# Altium project Placa_registros.PrjPcb (part 1 of 2)
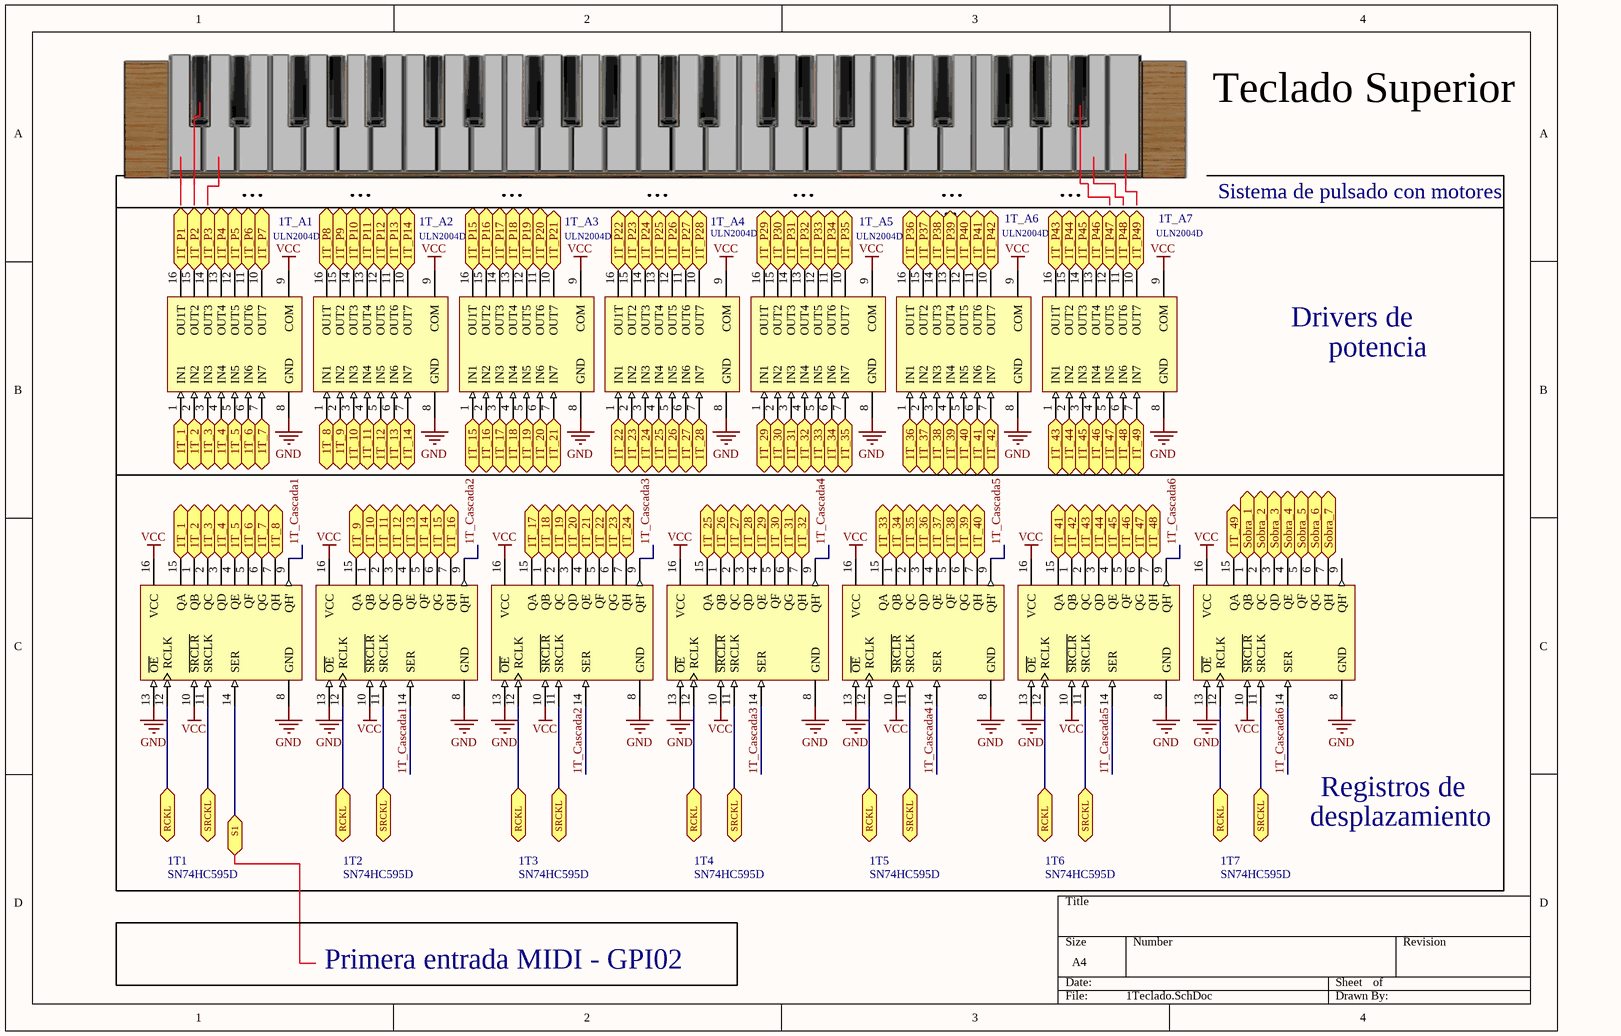
[diagram p0: 1Teclado.SchDoc]
10 sheets, 324 parts. Net scope: flat (ports and power ports of the same name join across sheets).
Board file: PCB_Organo.PcbDoc
Sheets:
  1Teclado.SchDoc
  2Teclado.SchDoc
  Valvulas.SchDoc
  Pedal.SchDoc
  Externos.SchDoc
  GPIO_Raspberry_b+.SchDoc
  LED´s_1Teclado.SchDoc
  LED´s_Teclado2.SchDoc
  LED´s_Valvulas.SchDoc
  LED´s_Pedal.SchDoc

## Sheet 1Teclado.SchDoc
size A4

### Parts
1T1  SN74HC595D  [D016_N]
1T2  SN74HC595D  [D016_N]
1T3  SN74HC595D  [D016_N]
1T4  SN74HC595D  [D016_N]
1T5  SN74HC595D  [D016_N]
1T6  SN74HC595D  [D016_N]
1T7  SN74HC595D  [D016_N]
1T_A1  ULN2004D  [SO16_N]
1T_A2  ULN2004D  [SO16_N]
1T_A3  ULN2004D  [SO16_N]
1T_A4  ULN2004D  [SO16_N]
1T_A5  ULN2004D  [SO16_N]
1T_A6  ULN2004D  [SO16_N]
1T_A7  ULN2004D  [SO16_N]

### Ports
1T_1, 1T_2, 1T_3, 1T_4, 1T_5, 1T_6, 1T_7, 1T_8, 1T_9, 1T_10, 1T_11, 1T_12, 1T_13, 1T_14, 1T_15, 1T_16, 1T_17, 1T_18, 1T_19, 1T_20, 1T_21, 1T_22, 1T_23, 1T_24, 1T_25, 1T_26, 1T_27, 1T_28, 1T_29, 1T_30, 1T_31, 1T_32, 1T_33, 1T_34, 1T_35, 1T_36, 1T_37, 1T_38, 1T_39, 1T_40, 1T_41, 1T_42, 1T_43, 1T_44, 1T_45, 1T_46, 1T_47, 1T_48, 1T_49, 1T_P1, 1T_P2, 1T_P3, 1T_P4, 1T_P5, 1T_P6, 1T_P7, 1T_P8, 1T_P9, 1T_P10, 1T_P11, 1T_P12, 1T_P13, 1T_P14, 1T_P15, 1T_P16, 1T_P17, 1T_P18, 1T_P19, 1T_P20, 1T_P21, 1T_P22, 1T_P23, 1T_P24, 1T_P25, 1T_P26, 1T_P27, 1T_P28, 1T_P29, 1T_P30, 1T_P31, 1T_P32, 1T_P33, 1T_P34, 1T_P35, 1T_P36, 1T_P37, 1T_P38, 1T_P39, 1T_P40, 1T_P41, 1T_P42, 1T_P43, 1T_P44, 1T_P45, 1T_P46, 1T_P47, 1T_P48, 1T_P49, RCKL, S1, Sobra_1, Sobra_2, Sobra_3, Sobra_4, Sobra_5, Sobra_6, Sobra_7, SRCKL

### Nets
GND: 1T1.8(GND) 1T1.13(~{OE}) 1T2.8(GND) 1T2.13(~{OE}) 1T3.8(GND) 1T3.13(~{OE}) 1T4.8(GND) 1T4.13(~{OE}) 1T5.8(GND) 1T5.13(~{OE}) 1T6.8(GND) 1T6.13(~{OE}) 1T7.8(GND) 1T7.13(~{OE}) 1T_A1.8(GND) 1T_A2.8(GND) 1T_A3.8(GND) 1T_A4.8(GND) 1T_A5.8(GND) 1T_A6.8(GND) 1T_A7.8(GND)
VCC: 1T1.10(~{SRCLR}) 1T1.16(VCC) 1T2.10(~{SRCLR}) 1T2.16(VCC) 1T3.10(~{SRCLR}) 1T3.16(VCC) 1T4.10(~{SRCLR}) 1T4.16(VCC) 1T5.10(~{SRCLR}) 1T5.16(VCC) 1T6.10(~{SRCLR}) 1T6.16(VCC) 1T7.10(~{SRCLR}) 1T7.16(VCC) 1T_A1.9(COM) 1T_A2.9(COM) 1T_A3.9(COM) 1T_A4.9(COM) 1T_A5.9(COM) 1T_A6.9(COM) 1T_A7.9(COM)
1T_Cascada1: 1T1.9(QH') 1T2.14(SER)
1T_Cascada2: 1T2.9(QH') 1T3.14(SER)
1T_Cascada3: 1T3.9(QH') 1T4.14(SER)
1T_Cascada4: 1T4.9(QH') 1T5.14(SER)
1T_Cascada5: 1T5.9(QH') 1T6.14(SER)
1T_Cascada6: 1T6.9(QH') 1T7.14(SER)
Net1T1_1: 1T1.1(QB) 1T_A1.2(IN2) ; port 1T_2
Net1T1_2: 1T1.2(QC) 1T_A1.3(IN3) ; port 1T_3
Net1T1_3: 1T1.3(QD) 1T_A1.4(IN4) ; port 1T_4
Net1T1_4: 1T1.4(QE) 1T_A1.5(IN5) ; port 1T_5
Net1T1_5: 1T1.5(QF) 1T_A1.6(IN6) ; port 1T_6
Net1T1_6: 1T1.6(QG) 1T_A1.7(IN7) ; port 1T_7
Net1T1_7: 1T1.7(QH) 1T_A2.1(IN1) ; port 1T_8
Net1T1_11: 1T1.11(SRCLK) 1T2.11(SRCLK) 1T3.11(SRCLK) 1T4.11(SRCLK) 1T5.11(SRCLK) 1T6.11(SRCLK) 1T7.11(SRCLK) ; port SRCKL
Net1T1_12: 1T1.12(RCLK) 1T2.12(RCLK) 1T3.12(RCLK) 1T4.12(RCLK) 1T5.12(RCLK) 1T6.12(RCLK) 1T7.12(RCLK) ; port RCKL
Net1T1_14: 1T1.14(SER) ; port S1
Net1T1_15: 1T1.15(QA) 1T_A1.1(IN1) ; port 1T_1
Net1T2_1: 1T2.1(QB) 1T_A2.3(IN3) ; port 1T_10
Net1T2_2: 1T2.2(QC) 1T_A2.4(IN4) ; port 1T_11
Net1T2_3: 1T2.3(QD) 1T_A2.5(IN5) ; port 1T_12
Net1T2_4: 1T2.4(QE) 1T_A2.6(IN6) ; port 1T_13
Net1T2_5: 1T2.5(QF) 1T_A2.7(IN7) ; port 1T_14
Net1T2_6: 1T2.6(QG) 1T_A3.1(IN1) ; port 1T_15
Net1T2_7: 1T2.7(QH) 1T_A3.2(IN2) ; port 1T_16
Net1T2_15: 1T2.15(QA) 1T_A2.2(IN2) ; port 1T_9
Net1T3_1: 1T3.1(QB) 1T_A3.4(IN4) ; port 1T_18
Net1T3_2: 1T3.2(QC) 1T_A3.5(IN5) ; port 1T_19
Net1T3_3: 1T3.3(QD) 1T_A3.6(IN6) ; port 1T_20
Net1T3_4: 1T3.4(QE) 1T_A3.7(IN7) ; port 1T_21
Net1T3_5: 1T3.5(QF) 1T_A4.1(IN1) ; port 1T_22
Net1T3_6: 1T3.6(QG) 1T_A4.2(IN2) ; port 1T_23
Net1T3_7: 1T3.7(QH) 1T_A4.3(IN3) ; port 1T_24
Net1T3_15: 1T3.15(QA) 1T_A3.3(IN3) ; port 1T_17
Net1T4_1: 1T4.1(QB) 1T_A4.5(IN5) ; port 1T_26
Net1T4_2: 1T4.2(QC) 1T_A4.6(IN6) ; port 1T_27
Net1T4_3: 1T4.3(QD) 1T_A4.7(IN7) ; port 1T_28
Net1T4_4: 1T4.4(QE) 1T_A5.1(IN1) ; port 1T_29
Net1T4_5: 1T4.5(QF) 1T_A5.2(IN2) ; port 1T_30
Net1T4_6: 1T4.6(QG) 1T_A5.3(IN3) ; port 1T_31
Net1T4_7: 1T4.7(QH) 1T_A5.4(IN4) ; port 1T_32
Net1T4_15: 1T4.15(QA) 1T_A4.4(IN4) ; port 1T_25
Net1T5_1: 1T5.1(QB) 1T_A5.6(IN6) ; port 1T_34
Net1T5_2: 1T5.2(QC) 1T_A5.7(IN7) ; port 1T_35
Net1T5_3: 1T5.3(QD) 1T_A6.1(IN1) ; port 1T_36
Net1T5_4: 1T5.4(QE) 1T_A6.2(IN2) ; port 1T_37
Net1T5_5: 1T5.5(QF) 1T_A6.3(IN3) ; port 1T_38
Net1T5_6: 1T5.6(QG) 1T_A6.4(IN4) ; port 1T_39
Net1T5_7: 1T5.7(QH) 1T_A6.5(IN5) ; port 1T_40
Net1T5_15: 1T5.15(QA) 1T_A5.5(IN5) ; port 1T_33
Net1T6_1: 1T6.1(QB) 1T_A6.7(IN7) ; port 1T_42
Net1T6_2: 1T6.2(QC) 1T_A7.1(IN1) ; port 1T_43
Net1T6_3: 1T6.3(QD) 1T_A7.2(IN2) ; port 1T_44
Net1T6_4: 1T6.4(QE) 1T_A7.3(IN3) ; port 1T_45
Net1T6_5: 1T6.5(QF) 1T_A7.4(IN4) ; port 1T_46
Net1T6_6: 1T6.6(QG) 1T_A7.5(IN5) ; port 1T_47
Net1T6_7: 1T6.7(QH) 1T_A7.6(IN6) ; port 1T_48
Net1T6_15: 1T6.15(QA) 1T_A6.6(IN6) ; port 1T_41
Net1T7_1: 1T7.1(QB) ; port Sobra_1
Net1T7_2: 1T7.2(QC) ; port Sobra_2
Net1T7_3: 1T7.3(QD) ; port Sobra_3
Net1T7_4: 1T7.4(QE) ; port Sobra_4
Net1T7_5: 1T7.5(QF) ; port Sobra_5
Net1T7_6: 1T7.6(QG) ; port Sobra_6
Net1T7_7: 1T7.7(QH) ; port Sobra_7
Net1T7_15: 1T7.15(QA) 1T_A7.7(IN7) ; port 1T_49
Net1T_A1_10: 1T_A1.10(OUT7) ; port 1T_P7
Net1T_A1_11: 1T_A1.11(OUT6) ; port 1T_P6
Net1T_A1_12: 1T_A1.12(OUT5) ; port 1T_P5
Net1T_A1_13: 1T_A1.13(OUT4) ; port 1T_P4
Net1T_A1_14: 1T_A1.14(OUT3) ; port 1T_P3
Net1T_A1_15: 1T_A1.15(OUT2) ; port 1T_P2
Net1T_A1_16: 1T_A1.16(OU1T) ; port 1T_P1
Net1T_A2_10: 1T_A2.10(OUT7) ; port 1T_P14
Net1T_A2_11: 1T_A2.11(OUT6) ; port 1T_P13
Net1T_A2_12: 1T_A2.12(OUT5) ; port 1T_P12
Net1T_A2_13: 1T_A2.13(OUT4) ; port 1T_P11
Net1T_A2_14: 1T_A2.14(OUT3) ; port 1T_P10
Net1T_A2_15: 1T_A2.15(OUT2) ; port 1T_P9
Net1T_A2_16: 1T_A2.16(OU1T) ; port 1T_P8
Net1T_A3_10: 1T_A3.10(OUT7) ; port 1T_P21
Net1T_A3_11: 1T_A3.11(OUT6) ; port 1T_P20
Net1T_A3_12: 1T_A3.12(OUT5) ; port 1T_P19
Net1T_A3_13: 1T_A3.13(OUT4) ; port 1T_P18
Net1T_A3_14: 1T_A3.14(OUT3) ; port 1T_P17
Net1T_A3_15: 1T_A3.15(OUT2) ; port 1T_P16
Net1T_A3_16: 1T_A3.16(OU1T) ; port 1T_P15
Net1T_A4_10: 1T_A4.10(OUT7) ; port 1T_P28
Net1T_A4_11: 1T_A4.11(OUT6) ; port 1T_P27
Net1T_A4_12: 1T_A4.12(OUT5) ; port 1T_P26
Net1T_A4_13: 1T_A4.13(OUT4) ; port 1T_P25
Net1T_A4_14: 1T_A4.14(OUT3) ; port 1T_P24
Net1T_A4_15: 1T_A4.15(OUT2) ; port 1T_P23
Net1T_A4_16: 1T_A4.16(OU1T) ; port 1T_P22
Net1T_A5_10: 1T_A5.10(OUT7) ; port 1T_P35
Net1T_A5_11: 1T_A5.11(OUT6) ; port 1T_P34
Net1T_A5_12: 1T_A5.12(OUT5) ; port 1T_P33
Net1T_A5_13: 1T_A5.13(OUT4) ; port 1T_P32
Net1T_A5_14: 1T_A5.14(OUT3) ; port 1T_P31
Net1T_A5_15: 1T_A5.15(OUT2) ; port 1T_P30
Net1T_A5_16: 1T_A5.16(OU1T) ; port 1T_P29
Net1T_A6_10: 1T_A6.10(OUT7) ; port 1T_P42
Net1T_A6_11: 1T_A6.11(OUT6) ; port 1T_P41
Net1T_A6_12: 1T_A6.12(OUT5) ; port 1T_P40
Net1T_A6_13: 1T_A6.13(OUT4) ; port 1T_P39
Net1T_A6_14: 1T_A6.14(OUT3) ; port 1T_P38
Net1T_A6_15: 1T_A6.15(OUT2) ; port 1T_P37
Net1T_A6_16: 1T_A6.16(OU1T) ; port 1T_P36
Net1T_A7_10: 1T_A7.10(OUT7) ; port 1T_P49
Net1T_A7_11: 1T_A7.11(OUT6) ; port 1T_P48
Net1T_A7_12: 1T_A7.12(OUT5) ; port 1T_P47
Net1T_A7_13: 1T_A7.13(OUT4) ; port 1T_P46
Net1T_A7_14: 1T_A7.14(OUT3) ; port 1T_P45
Net1T_A7_15: 1T_A7.15(OUT2) ; port 1T_P44
Net1T_A7_16: 1T_A7.16(OU1T) ; port 1T_P43

Not connected (* = marked no-connect by the designer): 1T7 9(QH')

### Notes on the sheet
- Teclado Superior
- ...
- Sistema de pulsado con motores
- Drivers de
- potencia
- desplazamiento
- Registros de
- Primera entrada MIDI - GPI02

### Library data of the parts
1T1-1T7 = SN74HC595D: 8-Bit Shift Register with 3-State Output Registers; Published: 8-Jun-2000; LatestRevisionDate: 13-Apr-2006; LatestRevisionNote: IPC-7351 Footprint Added.; DatasheetVersion: May-1997; PackageVersion: Jan-1998; PackageReference: D016; Publisher: Altium Limited; PackageDescription: 16-Pin Small Outline Integrated Circuit 1.27 mm Pitch; Code_IPC: SOIC127P600-16; ComponentLink1Description: Manufacturer Link; ComponentLink1URL: http://www.ti.com/; ComponentLink2Description: Datasheet; ComponentLink2URL: http://www-s.ti.com/sc/ds/sn74hc595.pdf
1T_A1-1T_A7 = ULN2004D: Seven Darlington Array; Published: 8-Jun-2000; LatestRevisionDate: 13-Apr-2006; LatestRevisionNote: IPC-7351 Footprint Added.; DatasheetVersion: Sep-1998; PackageVersion: May-1998; PackageReference: SO16; Publisher: Altium Limited; PackageDescription: 16-Pin Small Outline Integrated Circuit 1.27 mm Pitch; Code_IPC: SOIC127P600-16; ComponentLink1Description: Manufacturer Link; ComponentLink1URL: http://www.st.com/; ComponentLink2Description: Datasheet; ComponentLink2URL: http://www.st.com/stonline/products/literature/ds/5279/uln2001.pdf

## Sheet 2Teclado.SchDoc
size A4
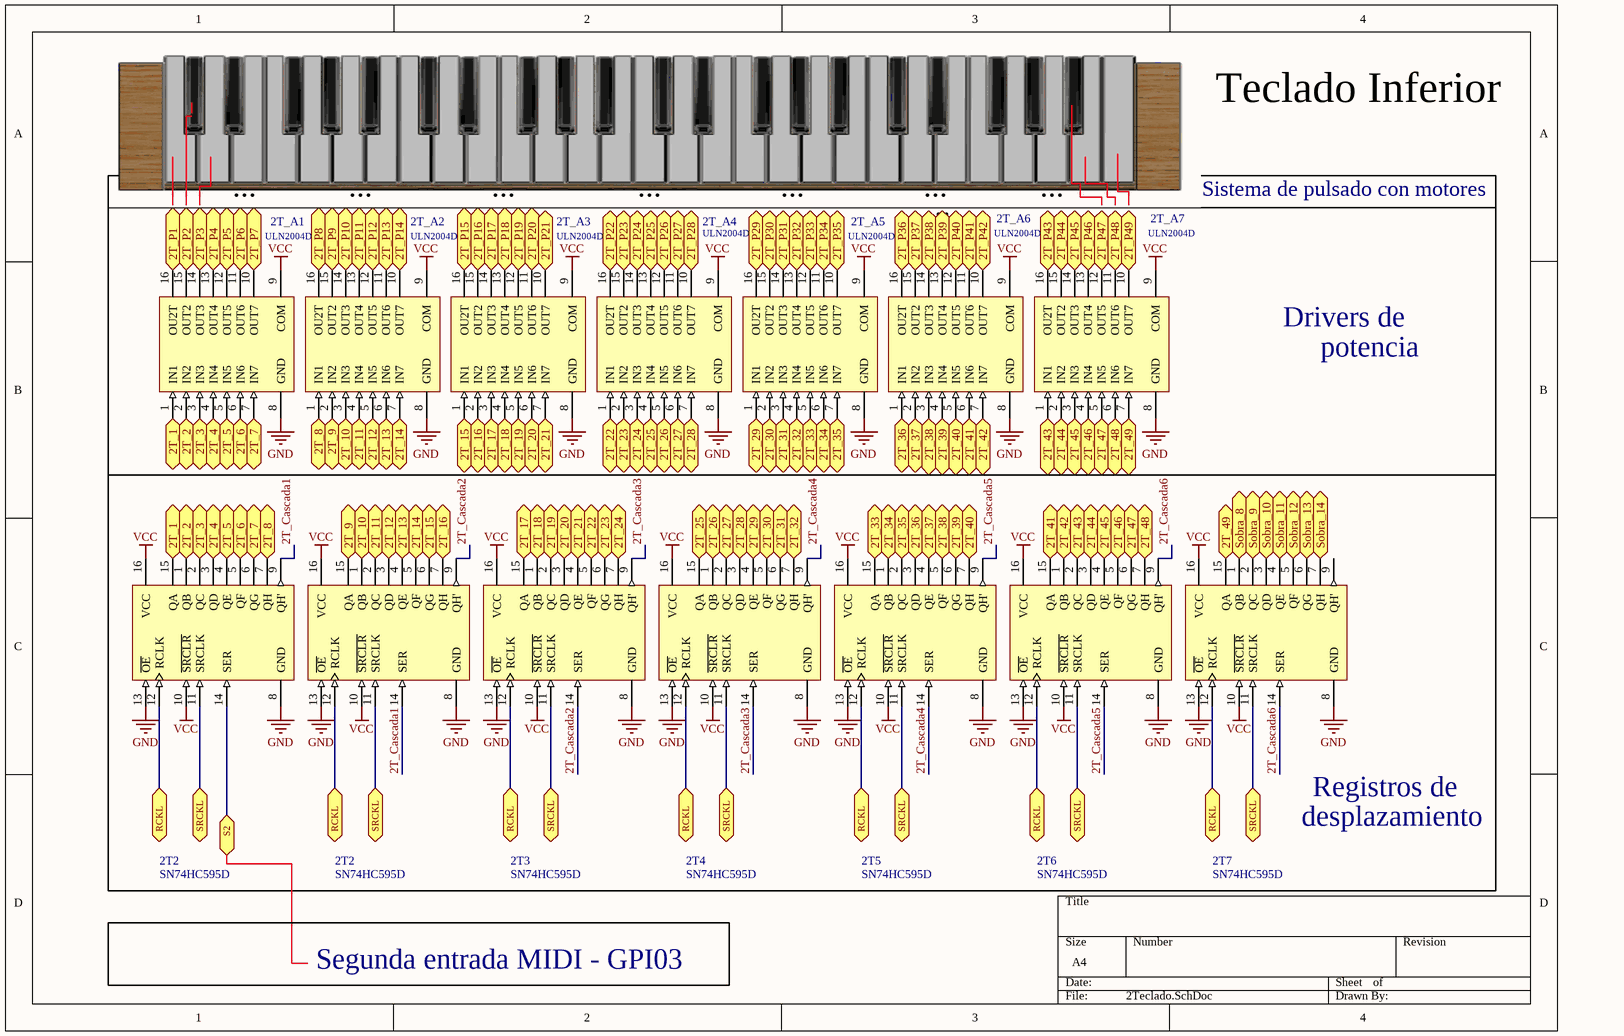
[diagram p1: 2Teclado.SchDoc]

### Parts
(Parts that share a designator on the sheet are numbered #1, #2 ... from top to bottom, then left to right.)
2T2#1  SN74HC595D  [D016_N]
2T2#2  SN74HC595D  [D016_N]
2T3  SN74HC595D  [D016_N]
2T4  SN74HC595D  [D016_N]
2T5  SN74HC595D  [D016_N]
2T6  SN74HC595D  [D016_N]
2T7  SN74HC595D  [D016_N]
2T_A1  ULN2004D  [SO16_N]
2T_A2  ULN2004D  [SO16_N]
2T_A3  ULN2004D  [SO16_N]
2T_A4  ULN2004D  [SO16_N]
2T_A5  ULN2004D  [SO16_N]
2T_A6  ULN2004D  [SO16_N]
2T_A7  ULN2004D  [SO16_N]

### Ports
2T_1, 2T_2, 2T_3, 2T_4, 2T_5, 2T_6, 2T_7, 2T_8, 2T_9, 2T_10, 2T_11, 2T_12, 2T_13, 2T_14, 2T_15, 2T_16, 2T_17, 2T_18, 2T_19, 2T_20, 2T_21, 2T_22, 2T_23, 2T_24, 2T_25, 2T_26, 2T_27, 2T_28, 2T_29, 2T_30, 2T_31, 2T_32, 2T_33, 2T_34, 2T_35, 2T_36, 2T_37, 2T_38, 2T_39, 2T_40, 2T_41, 2T_42, 2T_43, 2T_44, 2T_45, 2T_46, 2T_47, 2T_48, 2T_49, 2T_P1, 2T_P2, 2T_P3, 2T_P4, 2T_P5, 2T_P6, 2T_P7, 2T_P8, 2T_P9, 2T_P10, 2T_P11, 2T_P12, 2T_P13, 2T_P14, 2T_P15, 2T_P16, 2T_P17, 2T_P18, 2T_P19, 2T_P20, 2T_P21, 2T_P22, 2T_P23, 2T_P24, 2T_P25, 2T_P26, 2T_P27, 2T_P28, 2T_P29, 2T_P30, 2T_P31, 2T_P32, 2T_P33, 2T_P34, 2T_P35, 2T_P36, 2T_P37, 2T_P38, 2T_P39, 2T_P40, 2T_P41, 2T_P42, 2T_P43, 2T_P44, 2T_P45, 2T_P46, 2T_P47, 2T_P48, 2T_P49, RCKL, S2, Sobra_8, Sobra_9, Sobra_10, Sobra_11, Sobra_12, Sobra_13, Sobra_14, SRCKL

### Nets
GND: 2T2#1.8(GND) 2T2#1.13(~{OE}) 2T2#2.8(GND) 2T2#2.13(~{OE}) 2T3.8(GND) 2T3.13(~{OE}) 2T4.8(GND) 2T4.13(~{OE}) 2T5.8(GND) 2T5.13(~{OE}) 2T6.8(GND) 2T6.13(~{OE}) 2T7.8(GND) 2T7.13(~{OE}) 2T_A1.8(GND) 2T_A2.8(GND) 2T_A3.8(GND) 2T_A4.8(GND) 2T_A5.8(GND) 2T_A6.8(GND) 2T_A7.8(GND)
VCC: 2T2#1.10(~{SRCLR}) 2T2#1.16(VCC) 2T2#2.10(~{SRCLR}) 2T2#2.16(VCC) 2T3.10(~{SRCLR}) 2T3.16(VCC) 2T4.10(~{SRCLR}) 2T4.16(VCC) 2T5.10(~{SRCLR}) 2T5.16(VCC) 2T6.10(~{SRCLR}) 2T6.16(VCC) 2T7.10(~{SRCLR}) 2T7.16(VCC) 2T_A1.9(COM) 2T_A2.9(COM) 2T_A3.9(COM) 2T_A4.9(COM) 2T_A5.9(COM) 2T_A6.9(COM) 2T_A7.9(COM)
2T_Cascada1: 2T2#1.9(QH') 2T2#2.14(SER)
2T_Cascada2: 2T2#2.9(QH') 2T3.14(SER)
2T_Cascada3: 2T3.9(QH') 2T4.14(SER)
2T_Cascada4: 2T4.9(QH') 2T5.14(SER)
2T_Cascada5: 2T5.9(QH') 2T6.14(SER)
2T_Cascada6: 2T6.9(QH') 2T7.14(SER)
Net1T1_11: 2T2#1.11(SRCLK) 2T2#2.11(SRCLK) 2T3.11(SRCLK) 2T4.11(SRCLK) 2T5.11(SRCLK) 2T6.11(SRCLK) 2T7.11(SRCLK) ; port SRCKL
Net1T1_12: 2T2#1.12(RCLK) 2T2#2.12(RCLK) 2T3.12(RCLK) 2T4.12(RCLK) 2T5.12(RCLK) 2T6.12(RCLK) 2T7.12(RCLK) ; port RCKL
Net2T2#1_1: 2T2#1.1(QB) 2T_A1.2(IN2) ; port 2T_2
Net2T2#1_2: 2T2#1.2(QC) 2T_A1.3(IN3) ; port 2T_3
Net2T2#1_3: 2T2#1.3(QD) 2T_A1.4(IN4) ; port 2T_4
Net2T2#1_4: 2T2#1.4(QE) 2T_A1.5(IN5) ; port 2T_5
Net2T2#1_5: 2T2#1.5(QF) 2T_A1.6(IN6) ; port 2T_6
Net2T2#1_6: 2T2#1.6(QG) 2T_A1.7(IN7) ; port 2T_7
Net2T2#1_7: 2T2#1.7(QH) 2T_A2.1(IN1) ; port 2T_8
Net2T2#1_14: 2T2#1.14(SER) ; port S2
Net2T2#1_15: 2T2#1.15(QA) 2T_A1.1(IN1) ; port 2T_1
Net2T2#2_1: 2T2#2.1(QB) 2T_A2.3(IN3) ; port 2T_10
Net2T2#2_2: 2T2#2.2(QC) 2T_A2.4(IN4) ; port 2T_11
Net2T2#2_3: 2T2#2.3(QD) 2T_A2.5(IN5) ; port 2T_12
Net2T2#2_4: 2T2#2.4(QE) 2T_A2.6(IN6) ; port 2T_13
Net2T2#2_5: 2T2#2.5(QF) 2T_A2.7(IN7) ; port 2T_14
Net2T2#2_6: 2T2#2.6(QG) 2T_A3.1(IN1) ; port 2T_15
Net2T2#2_7: 2T2#2.7(QH) 2T_A3.2(IN2) ; port 2T_16
Net2T2#2_15: 2T2#2.15(QA) 2T_A2.2(IN2) ; port 2T_9
Net2T3_1: 2T3.1(QB) 2T_A3.4(IN4) ; port 2T_18
Net2T3_2: 2T3.2(QC) 2T_A3.5(IN5) ; port 2T_19
Net2T3_3: 2T3.3(QD) 2T_A3.6(IN6) ; port 2T_20
Net2T3_4: 2T3.4(QE) 2T_A3.7(IN7) ; port 2T_21
Net2T3_5: 2T3.5(QF) 2T_A4.1(IN1) ; port 2T_22
Net2T3_6: 2T3.6(QG) 2T_A4.2(IN2) ; port 2T_23
Net2T3_7: 2T3.7(QH) 2T_A4.3(IN3) ; port 2T_24
Net2T3_15: 2T3.15(QA) 2T_A3.3(IN3) ; port 2T_17
Net2T4_1: 2T4.1(QB) 2T_A4.5(IN5) ; port 2T_26
Net2T4_2: 2T4.2(QC) 2T_A4.6(IN6) ; port 2T_27
Net2T4_3: 2T4.3(QD) 2T_A4.7(IN7) ; port 2T_28
Net2T4_4: 2T4.4(QE) 2T_A5.1(IN1) ; port 2T_29
Net2T4_5: 2T4.5(QF) 2T_A5.2(IN2) ; port 2T_30
Net2T4_6: 2T4.6(QG) 2T_A5.3(IN3) ; port 2T_31
Net2T4_7: 2T4.7(QH) 2T_A5.4(IN4) ; port 2T_32
Net2T4_15: 2T4.15(QA) 2T_A4.4(IN4) ; port 2T_25
Net2T5_1: 2T5.1(QB) 2T_A5.6(IN6) ; port 2T_34
Net2T5_2: 2T5.2(QC) 2T_A5.7(IN7) ; port 2T_35
Net2T5_3: 2T5.3(QD) 2T_A6.1(IN1) ; port 2T_36
Net2T5_4: 2T5.4(QE) 2T_A6.2(IN2) ; port 2T_37
Net2T5_5: 2T5.5(QF) 2T_A6.3(IN3) ; port 2T_38
Net2T5_6: 2T5.6(QG) 2T_A6.4(IN4) ; port 2T_39
Net2T5_7: 2T5.7(QH) 2T_A6.5(IN5) ; port 2T_40
Net2T5_15: 2T5.15(QA) 2T_A5.5(IN5) ; port 2T_33
Net2T6_1: 2T6.1(QB) 2T_A6.7(IN7) ; port 2T_42
Net2T6_2: 2T6.2(QC) 2T_A7.1(IN1) ; port 2T_43
Net2T6_3: 2T6.3(QD) 2T_A7.2(IN2) ; port 2T_44
Net2T6_4: 2T6.4(QE) 2T_A7.3(IN3) ; port 2T_45
Net2T6_5: 2T6.5(QF) 2T_A7.4(IN4) ; port 2T_46
Net2T6_6: 2T6.6(QG) 2T_A7.5(IN5) ; port 2T_47
Net2T6_7: 2T6.7(QH) 2T_A7.6(IN6) ; port 2T_48
Net2T6_15: 2T6.15(QA) 2T_A6.6(IN6) ; port 2T_41
Net2T7_1: 2T7.1(QB) ; port Sobra_8
Net2T7_2: 2T7.2(QC) ; port Sobra_9
Net2T7_3: 2T7.3(QD) ; port Sobra_10
Net2T7_4: 2T7.4(QE) ; port Sobra_11
Net2T7_5: 2T7.5(QF) ; port Sobra_12
Net2T7_6: 2T7.6(QG) ; port Sobra_13
Net2T7_7: 2T7.7(QH) ; port Sobra_14
Net2T7_15: 2T7.15(QA) 2T_A7.7(IN7) ; port 2T_49
Net2T_A1_10: 2T_A1.10(OUT7) ; port 2T_P7
Net2T_A1_11: 2T_A1.11(OUT6) ; port 2T_P6
Net2T_A1_12: 2T_A1.12(OUT5) ; port 2T_P5
Net2T_A1_13: 2T_A1.13(OUT4) ; port 2T_P4
Net2T_A1_14: 2T_A1.14(OUT3) ; port 2T_P3
Net2T_A1_15: 2T_A1.15(OUT2) ; port 2T_P2
Net2T_A1_16: 2T_A1.16(OU2T) ; port 2T_P1
Net2T_A2_10: 2T_A2.10(OUT7) ; port 2T_P14
Net2T_A2_11: 2T_A2.11(OUT6) ; port 2T_P13
Net2T_A2_12: 2T_A2.12(OUT5) ; port 2T_P12
Net2T_A2_13: 2T_A2.13(OUT4) ; port 2T_P11
Net2T_A2_14: 2T_A2.14(OUT3) ; port 2T_P10
Net2T_A2_15: 2T_A2.15(OUT2) ; port 2T_P9
Net2T_A2_16: 2T_A2.16(OU2T) ; port 2T_P8
Net2T_A3_10: 2T_A3.10(OUT7) ; port 2T_P21
Net2T_A3_11: 2T_A3.11(OUT6) ; port 2T_P20
Net2T_A3_12: 2T_A3.12(OUT5) ; port 2T_P19
Net2T_A3_13: 2T_A3.13(OUT4) ; port 2T_P18
Net2T_A3_14: 2T_A3.14(OUT3) ; port 2T_P17
Net2T_A3_15: 2T_A3.15(OUT2) ; port 2T_P16
Net2T_A3_16: 2T_A3.16(OU2T) ; port 2T_P15
Net2T_A4_10: 2T_A4.10(OUT7) ; port 2T_P28
Net2T_A4_11: 2T_A4.11(OUT6) ; port 2T_P27
Net2T_A4_12: 2T_A4.12(OUT5) ; port 2T_P26
Net2T_A4_13: 2T_A4.13(OUT4) ; port 2T_P25
Net2T_A4_14: 2T_A4.14(OUT3) ; port 2T_P24
Net2T_A4_15: 2T_A4.15(OUT2) ; port 2T_P23
Net2T_A4_16: 2T_A4.16(OU2T) ; port 2T_P22
Net2T_A5_10: 2T_A5.10(OUT7) ; port 2T_P35
Net2T_A5_11: 2T_A5.11(OUT6) ; port 2T_P34
Net2T_A5_12: 2T_A5.12(OUT5) ; port 2T_P33
Net2T_A5_13: 2T_A5.13(OUT4) ; port 2T_P32
Net2T_A5_14: 2T_A5.14(OUT3) ; port 2T_P31
Net2T_A5_15: 2T_A5.15(OUT2) ; port 2T_P30
Net2T_A5_16: 2T_A5.16(OU2T) ; port 2T_P29
Net2T_A6_10: 2T_A6.10(OUT7) ; port 2T_P42
Net2T_A6_11: 2T_A6.11(OUT6) ; port 2T_P41
Net2T_A6_12: 2T_A6.12(OUT5) ; port 2T_P40
Net2T_A6_13: 2T_A6.13(OUT4) ; port 2T_P39
Net2T_A6_14: 2T_A6.14(OUT3) ; port 2T_P38
Net2T_A6_15: 2T_A6.15(OUT2) ; port 2T_P37
Net2T_A6_16: 2T_A6.16(OU2T) ; port 2T_P36
Net2T_A7_10: 2T_A7.10(OUT7) ; port 2T_P49
Net2T_A7_11: 2T_A7.11(OUT6) ; port 2T_P48
Net2T_A7_12: 2T_A7.12(OUT5) ; port 2T_P47
Net2T_A7_13: 2T_A7.13(OUT4) ; port 2T_P46
Net2T_A7_14: 2T_A7.14(OUT3) ; port 2T_P45
Net2T_A7_15: 2T_A7.15(OUT2) ; port 2T_P44
Net2T_A7_16: 2T_A7.16(OU2T) ; port 2T_P43

Not connected (* = marked no-connect by the designer): 2T7 9(QH')

### Notes on the sheet
- Teclado Inferior
- ...
- Sistema de pulsado con motores
- Drivers de
- potencia
- desplazamiento
- Registros de
- Segunda entrada MIDI - GPI03

### Library data of the parts
2T2#1 2T2#2 2T3-2T7 = SN74HC595D: as 1T1 on sheet 1Teclado; Published: 8-Jun-2000; LatestRevisionDate: 13-Apr-2006; LatestRevisionNote: IPC-7351 Footprint Added.; DatasheetVersion: May-1997; PackageVersion: Jan-1998; PackageReference: D016; Publisher: Altium Limited; PackageDescription: 16-Pin Small Outline Integrated Circuit 1.27 mm Pitch; Code_IPC: SOIC127P600-16; ComponentLink1Description: Manufacturer Link; ComponentLink1URL: http://www.ti.com/; ComponentLink2Description: Datasheet; ComponentLink2URL: http://www-s.ti.com/sc/ds/sn74hc595.pdf
2T_A1-2T_A7 = ULN2004D: Seven Darlington Array; Published: 8-Jun-2000; LatestRevisionDate: 13-Apr-2006; LatestRevisionNote: IPC-7351 Footprint Added.; DatasheetVersion: Sep-1998; PackageVersion: May-1998; PackageReference: SO16; Publisher: Altium Limited; PackageDescription: 16-Pin Small Outline Integrated Circuit 1.27 mm Pitch; Code_IPC: SOIC127P600-16; ComponentLink1Description: Manufacturer Link; ComponentLink1URL: http://www.st.com/; ComponentLink2Description: Datasheet; ComponentLink2URL: http://www.st.com/stonline/products/literature/ds/5279/uln2001.pdf

## Sheet Valvulas.SchDoc
size A4
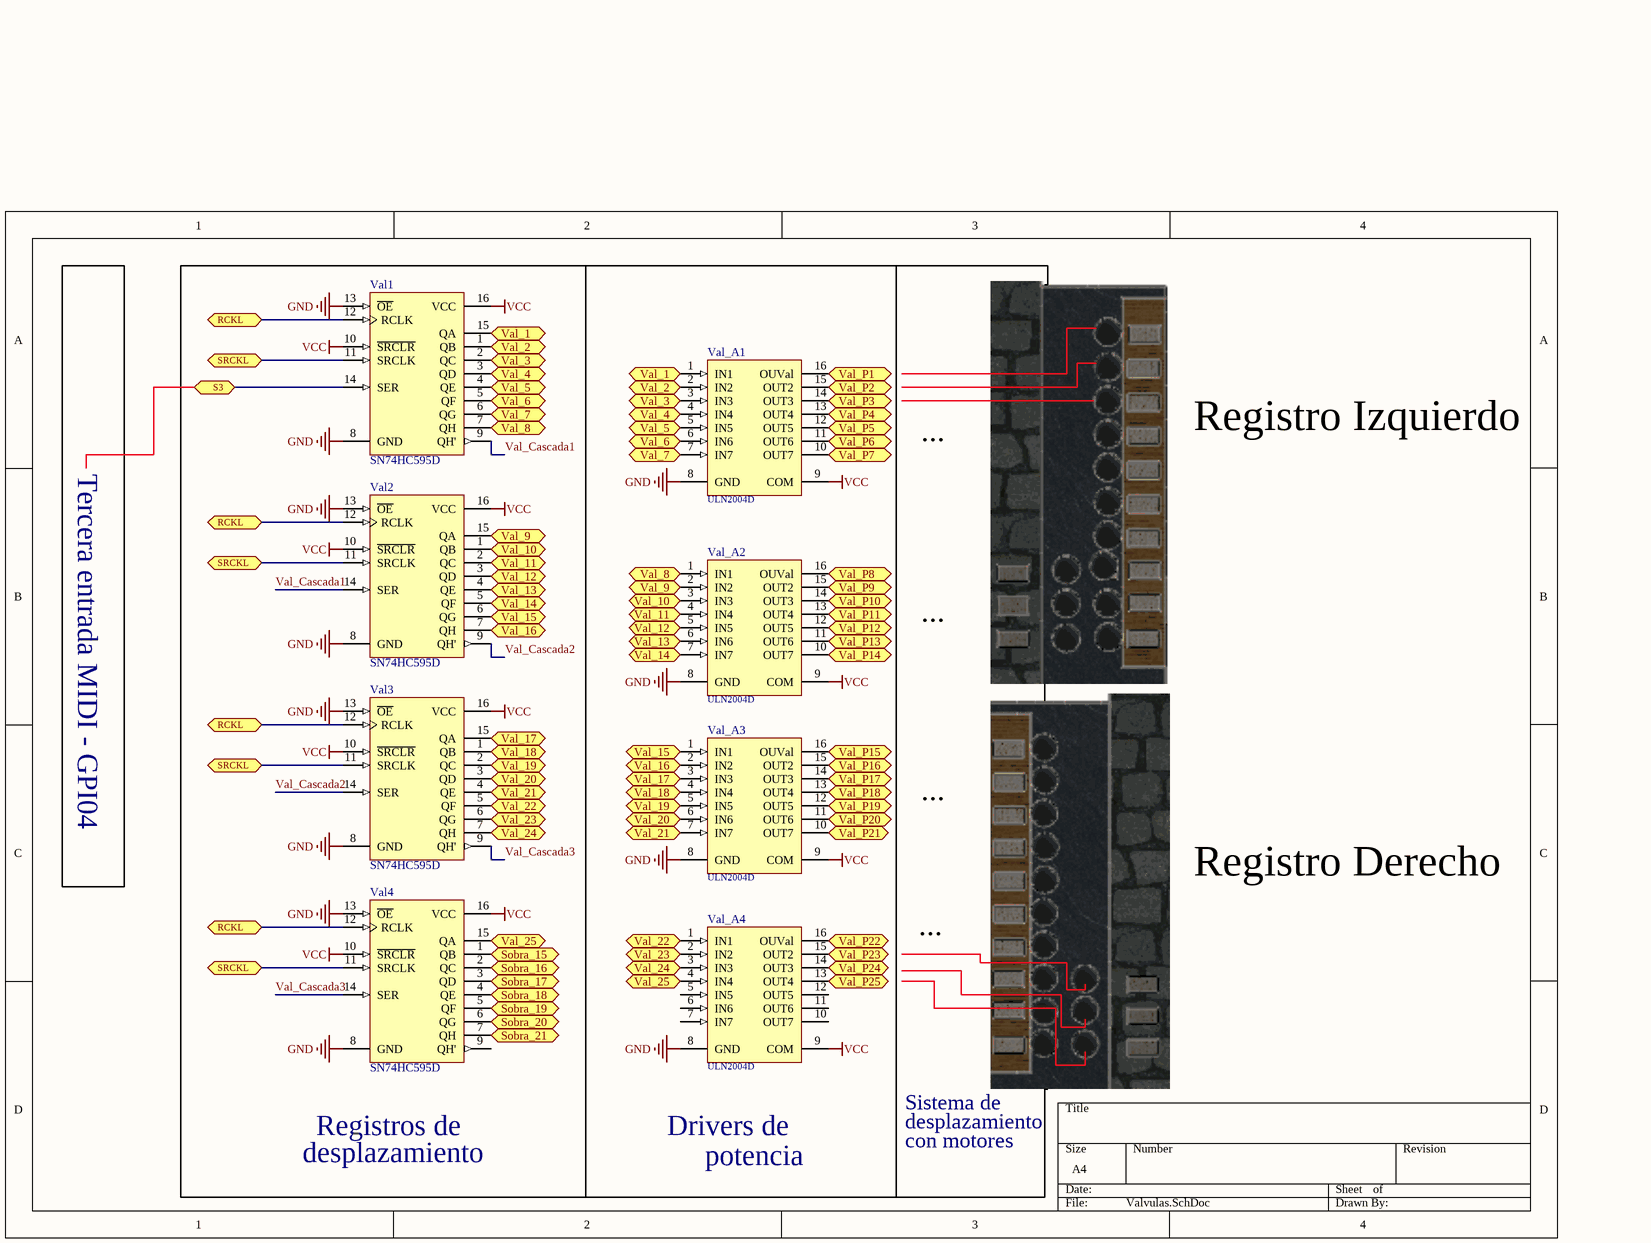
[diagram p2: Valvulas.SchDoc]

### Parts
Val1  SN74HC595D  [D016_N]
Val2  SN74HC595D  [D016_N]
Val3  SN74HC595D  [D016_N]
Val4  SN74HC595D  [D016_N]
Val_A1  ULN2004D  [SO16_N]
Val_A2  ULN2004D  [SO16_N]
Val_A3  ULN2004D  [SO16_N]
Val_A4  ULN2004D  [SO16_N]

### Ports
RCKL, S3, Sobra_15, Sobra_16, Sobra_17, Sobra_18, Sobra_19, Sobra_20, Sobra_21, SRCKL, Val_1, Val_2, Val_3, Val_4, Val_5, Val_6, Val_7, Val_8, Val_9, Val_10, Val_11, Val_12, Val_13, Val_14, Val_15, Val_16, Val_17, Val_18, Val_19, Val_20, Val_21, Val_22, Val_23, Val_24, Val_25, Val_P1, Val_P2, Val_P3, Val_P4, Val_P5, Val_P6, Val_P7, Val_P8, Val_P9, Val_P10, Val_P11, Val_P12, Val_P13, Val_P14, Val_P15, Val_P16, Val_P17, Val_P18, Val_P19, Val_P20, Val_P21, Val_P22, Val_P23, Val_P24, Val_P25

### Nets
GND: Val1.8(GND) Val1.13(~{OE}) Val2.8(GND) Val2.13(~{OE}) Val3.8(GND) Val3.13(~{OE}) Val4.8(GND) Val4.13(~{OE}) Val_A1.8(GND) Val_A2.8(GND) Val_A3.8(GND) Val_A4.8(GND)
VCC: Val1.10(~{SRCLR}) Val1.16(VCC) Val2.10(~{SRCLR}) Val2.16(VCC) Val3.10(~{SRCLR}) Val3.16(VCC) Val4.10(~{SRCLR}) Val4.16(VCC) Val_A1.9(COM) Val_A2.9(COM) Val_A3.9(COM) Val_A4.9(COM)
Val_Cascada1: Val1.9(QH') Val2.14(SER)
Val_Cascada2: Val2.9(QH') Val3.14(SER)
Val_Cascada3: Val3.9(QH') Val4.14(SER)
Net1T1_11: Val1.11(SRCLK) Val2.11(SRCLK) Val3.11(SRCLK) Val4.11(SRCLK) ; port SRCKL
Net1T1_12: Val1.12(RCLK) Val2.12(RCLK) Val3.12(RCLK) Val4.12(RCLK) ; port RCKL
Net*_7: Val1.14(SER) ; port S3
NetPines_Sobrantes_2: Val4.1(QB) ; port Sobra_15
NetPines_Sobrantes_4: Val4.2(QC) ; port Sobra_16
NetPines_Sobrantes_6: Val4.3(QD) ; port Sobra_17
NetPines_Sobrantes_8: Val4.4(QE) ; port Sobra_18
NetPines_Sobrantes_10: Val4.5(QF) ; port Sobra_19
NetPines_Sobrantes_12: Val4.6(QG) ; port Sobra_20
NetPines_Sobrantes_14: Val4.7(QH) ; port Sobra_21
NetPines_Valvulas_1: Val_A1.16(OUVal) ; port Val_P1
NetPines_Valvulas_2: Val_A2.10(OUT7) ; port Val_P14
NetPines_Valvulas_3: Val_A1.15(OUT2) ; port Val_P2
NetPines_Valvulas_4: Val_A3.16(OUVal) ; port Val_P15
NetPines_Valvulas_5: Val_A1.14(OUT3) ; port Val_P3
NetPines_Valvulas_6: Val_A3.15(OUT2) ; port Val_P16
NetPines_Valvulas_7: Val_A1.13(OUT4) ; port Val_P4
NetPines_Valvulas_8: Val_A3.14(OUT3) ; port Val_P17
NetPines_Valvulas_9: Val_A1.12(OUT5) ; port Val_P5
NetPines_Valvulas_10: Val_A3.13(OUT4) ; port Val_P18
NetPines_Valvulas_11: Val_A1.11(OUT6) ; port Val_P6
NetPines_Valvulas_12: Val_A3.12(OUT5) ; port Val_P19
NetPines_Valvulas_13: Val_A1.10(OUT7) ; port Val_P7
NetPines_Valvulas_14: Val_A3.11(OUT6) ; port Val_P20
NetPines_Valvulas_15: Val_A2.16(OUVal) ; port Val_P8
NetPines_Valvulas_16: Val_A3.10(OUT7) ; port Val_P21
NetPines_Valvulas_17: Val_A2.15(OUT2) ; port Val_P9
NetPines_Valvulas_18: Val_A4.16(OUVal) ; port Val_P22
NetPines_Valvulas_19: Val_A2.14(OUT3) ; port Val_P10
NetPines_Valvulas_20: Val_A4.15(OUT2) ; port Val_P23
NetPines_Valvulas_21: Val_A2.13(OUT4) ; port Val_P11
NetPines_Valvulas_22: Val_A4.14(OUT3) ; port Val_P24
NetPines_Valvulas_23: Val_A2.12(OUT5) ; port Val_P12
NetPines_Valvulas_24: Val_A4.13(OUT4) ; port Val_P25
NetPines_Valvulas_25: Val_A2.11(OUT6) ; port Val_P13
NetVal1_1: Val1.1(QB) Val_A1.2(IN2) ; port Val_2
NetVal1_2: Val1.2(QC) Val_A1.3(IN3) ; port Val_3
NetVal1_3: Val1.3(QD) Val_A1.4(IN4) ; port Val_4
NetVal1_4: Val1.4(QE) Val_A1.5(IN5) ; port Val_5
NetVal1_5: Val1.5(QF) Val_A1.6(IN6) ; port Val_6
NetVal1_6: Val1.6(QG) Val_A1.7(IN7) ; port Val_7
NetVal1_7: Val1.7(QH) Val_A2.1(IN1) ; port Val_8
NetVal1_15: Val1.15(QA) Val_A1.1(IN1) ; port Val_1
NetVal2_1: Val2.1(QB) Val_A2.3(IN3) ; port Val_10
NetVal2_2: Val2.2(QC) Val_A2.4(IN4) ; port Val_11
NetVal2_3: Val2.3(QD) Val_A2.5(IN5) ; port Val_12
NetVal2_4: Val2.4(QE) Val_A2.6(IN6) ; port Val_13
NetVal2_5: Val2.5(QF) Val_A2.7(IN7) ; port Val_14
NetVal2_6: Val2.6(QG) Val_A3.1(IN1) ; port Val_15
NetVal2_7: Val2.7(QH) Val_A3.2(IN2) ; port Val_16
NetVal2_15: Val2.15(QA) Val_A2.2(IN2) ; port Val_9
NetVal3_1: Val3.1(QB) Val_A3.4(IN4) ; port Val_18
NetVal3_2: Val3.2(QC) Val_A3.5(IN5) ; port Val_19
NetVal3_3: Val3.3(QD) Val_A3.6(IN6) ; port Val_20
NetVal3_4: Val3.4(QE) Val_A3.7(IN7) ; port Val_21
NetVal3_5: Val3.5(QF) Val_A4.1(IN1) ; port Val_22
NetVal3_6: Val3.6(QG) Val_A4.2(IN2) ; port Val_23
NetVal3_7: Val3.7(QH) Val_A4.3(IN3) ; port Val_24
NetVal3_15: Val3.15(QA) Val_A3.3(IN3) ; port Val_17
NetVal4_15: Val4.15(QA) Val_A4.4(IN4) ; port Val_25

Not connected (* = marked no-connect by the designer): Val4 9(QH'); Val_A4 5(IN5) 6(IN6) 7(IN7) 10(OUT7) 11(OUT6) 12(OUT5)

### Notes on the sheet
- ...
- Registro Izquierdo
- Tercera entrada MIDI - GPI04
- Registro Derecho
- Sistema de
- desplazamiento
- Registros de
- Drivers de
- potencia
- con motores

### Library data of the parts
Val1-Val4 = SN74HC595D: as 1T1 on sheet 1Teclado; Published: 8-Jun-2000; LatestRevisionDate: 13-Apr-2006; LatestRevisionNote: IPC-7351 Footprint Added.; DatasheetVersion: May-1997; PackageVersion: Jan-1998; PackageReference: D016; Publisher: Altium Limited; PackageDescription: 16-Pin Small Outline Integrated Circuit 1.27 mm Pitch; Code_IPC: SOIC127P600-16; ComponentLink1Description: Manufacturer Link; ComponentLink1URL: http://www.ti.com/; ComponentLink2Description: Datasheet; ComponentLink2URL: http://www-s.ti.com/sc/ds/sn74hc595.pdf
Val_A1-Val_A4 = ULN2004D: Seven Darlington Array; Published: 8-Jun-2000; LatestRevisionDate: 13-Apr-2006; LatestRevisionNote: IPC-7351 Footprint Added.; DatasheetVersion: Sep-1998; PackageVersion: May-1998; PackageReference: SO16; Publisher: Altium Limited; PackageDescription: 16-Pin Small Outline Integrated Circuit 1.27 mm Pitch; Code_IPC: SOIC127P600-16; ComponentLink1Description: Manufacturer Link; ComponentLink1URL: http://www.st.com/; ComponentLink2Description: Datasheet; ComponentLink2URL: http://www.st.com/stonline/products/literature/ds/5279/uln2001.pdf

## Sheet Pedal.SchDoc
size A4
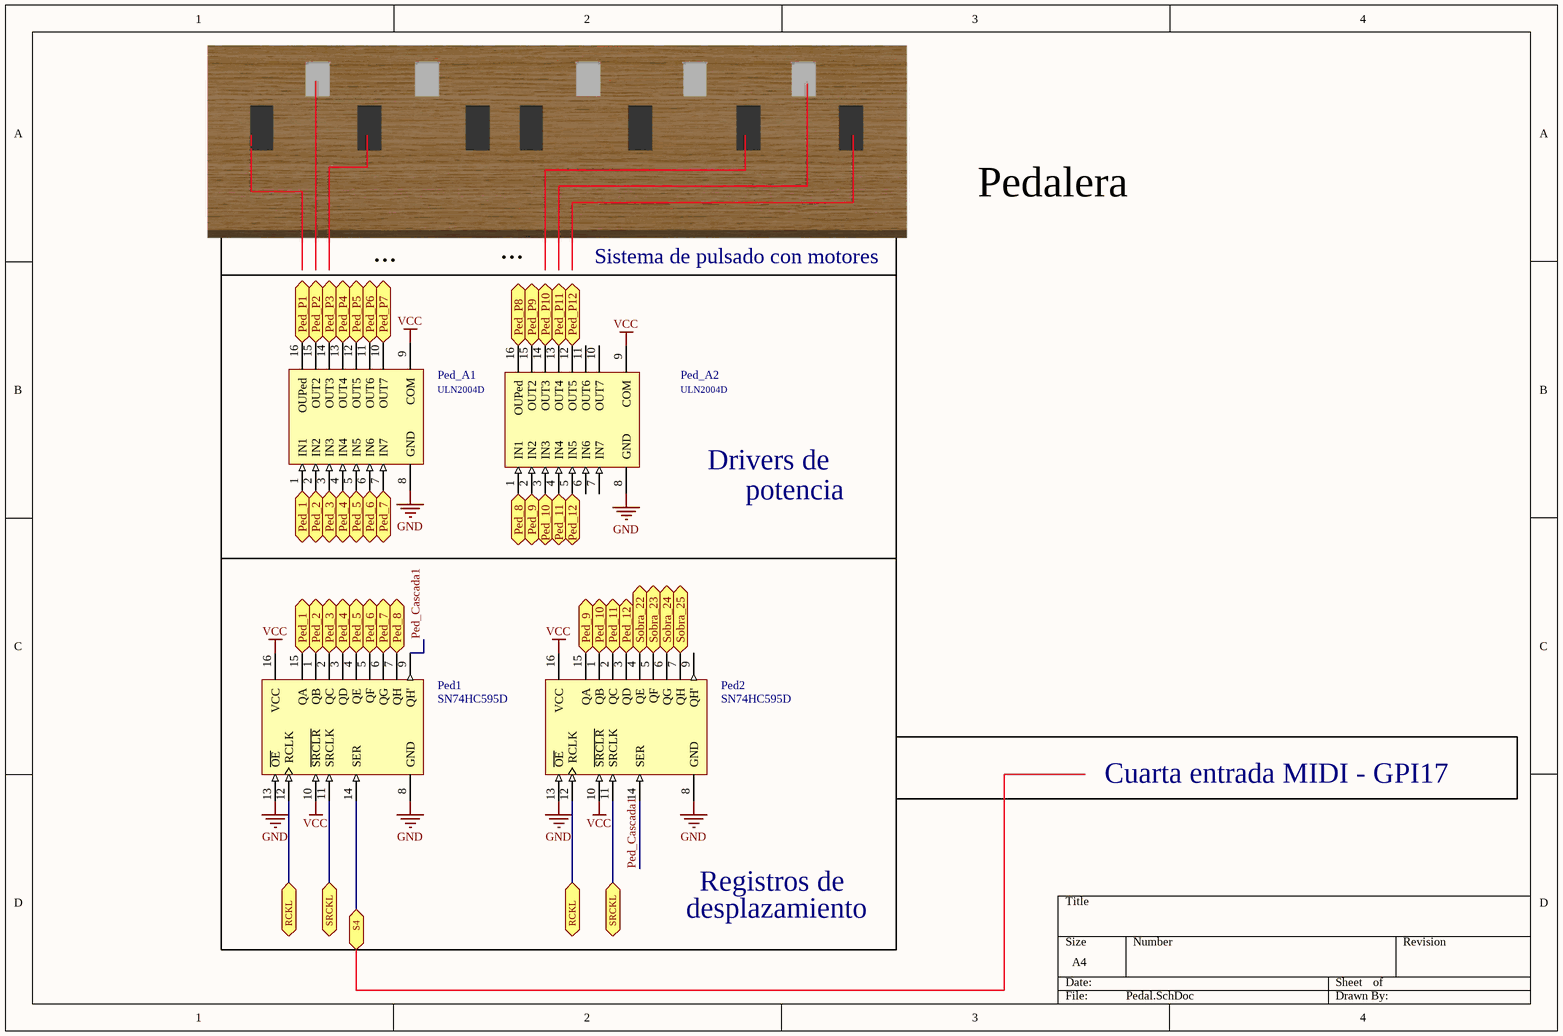
[diagram p3: Pedal.SchDoc]

### Parts
Ped1  SN74HC595D  [D016_N]
Ped2  SN74HC595D  [D016_N]
Ped_A1  ULN2004D  [SO16_N]
Ped_A2  ULN2004D  [SO16_N]

### Ports
Ped_1, Ped_2, Ped_3, Ped_4, Ped_5, Ped_6, Ped_7, Ped_8, Ped_9, Ped_10, Ped_11, Ped_12, Ped_P1, Ped_P2, Ped_P3, Ped_P4, Ped_P5, Ped_P6, Ped_P7, Ped_P8, Ped_P9, Ped_P10, Ped_P11, Ped_P12, RCKL, S4, Sobra_22, Sobra_23, Sobra_24, Sobra_25, SRCKL

### Nets
GND: Ped1.8(GND) Ped1.13(~{OE}) Ped2.8(GND) Ped2.13(~{OE}) Ped_A1.8(GND) Ped_A2.8(GND)
VCC: Ped1.10(~{SRCLR}) Ped1.16(VCC) Ped2.10(~{SRCLR}) Ped2.16(VCC) Ped_A1.9(COM) Ped_A2.9(COM)
Ped_Cascada1: Ped1.9(QH') Ped2.14(SER)
Net1T1_11: Ped1.11(SRCLK) Ped2.11(SRCLK) ; port SRCKL
Net1T1_12: Ped1.12(RCLK) Ped2.12(RCLK) ; port RCKL
Net*_11: Ped1.14(SER) ; port S4
NetPed1_1: Ped1.1(QB) Ped_A1.2(IN2) ; port Ped_2
NetPed1_2: Ped1.2(QC) Ped_A1.3(IN3) ; port Ped_3
NetPed1_3: Ped1.3(QD) Ped_A1.4(IN4) ; port Ped_4
NetPed1_4: Ped1.4(QE) Ped_A1.5(IN5) ; port Ped_5
NetPed1_5: Ped1.5(QF) Ped_A1.6(IN6) ; port Ped_6
NetPed1_6: Ped1.6(QG) Ped_A1.7(IN7) ; port Ped_7
NetPed1_7: Ped1.7(QH) Ped_A2.1(IN1) ; port Ped_8
NetPed1_15: Ped1.15(QA) Ped_A1.1(IN1) ; port Ped_1
NetPed2_1: Ped2.1(QB) Ped_A2.3(IN3) ; port Ped_10
NetPed2_2: Ped2.2(QC) Ped_A2.4(IN4) ; port Ped_11
NetPed2_3: Ped2.3(QD) Ped_A2.5(IN5) ; port Ped_12
NetPed2_4: Ped2.4(QE) ; port Sobra_22
NetPed2_5: Ped2.5(QF) ; port Sobra_23
NetPed2_6: Ped2.6(QG) ; port Sobra_24
NetPed2_7: Ped2.7(QH) ; port Sobra_25
NetPed2_15: Ped2.15(QA) Ped_A2.2(IN2) ; port Ped_9
NetPed_A1_10: Ped_A1.10(OUT7) ; port Ped_P7
NetPed_A1_11: Ped_A1.11(OUT6) ; port Ped_P6
NetPed_A1_12: Ped_A1.12(OUT5) ; port Ped_P5
NetPed_A1_13: Ped_A1.13(OUT4) ; port Ped_P4
NetPed_A1_14: Ped_A1.14(OUT3) ; port Ped_P3
NetPed_A1_15: Ped_A1.15(OUT2) ; port Ped_P2
NetPed_A1_16: Ped_A1.16(OUPed) ; port Ped_P1
NetPed_A2_12: Ped_A2.12(OUT5) ; port Ped_P12
NetPed_A2_13: Ped_A2.13(OUT4) ; port Ped_P11
NetPed_A2_14: Ped_A2.14(OUT3) ; port Ped_P10
NetPed_A2_15: Ped_A2.15(OUT2) ; port Ped_P9
NetPed_A2_16: Ped_A2.16(OUPed) ; port Ped_P8

Not connected (* = marked no-connect by the designer): Ped2 9(QH'); Ped_A2 6(IN6) 7(IN7) 10(OUT7) 11(OUT6)

### Notes on the sheet
- Pedalera
- ...
- Sistema de pulsado con motores
- Drivers de
- potencia
- Cuarta entrada MIDI - GPI17
- desplazamiento
- Registros de

### Library data of the parts
Ped1 Ped2 = SN74HC595D: as 1T1 on sheet 1Teclado; Published: 8-Jun-2000; LatestRevisionDate: 13-Apr-2006; LatestRevisionNote: IPC-7351 Footprint Added.; DatasheetVersion: May-1997; PackageVersion: Jan-1998; PackageReference: D016; Publisher: Altium Limited; PackageDescription: 16-Pin Small Outline Integrated Circuit 1.27 mm Pitch; Code_IPC: SOIC127P600-16; ComponentLink1Description: Manufacturer Link; ComponentLink1URL: http://www.ti.com/; ComponentLink2Description: Datasheet; ComponentLink2URL: http://www-s.ti.com/sc/ds/sn74hc595.pdf
Ped_A1 Ped_A2 = ULN2004D: Seven Darlington Array; Published: 8-Jun-2000; LatestRevisionDate: 13-Apr-2006; LatestRevisionNote: IPC-7351 Footprint Added.; DatasheetVersion: Sep-1998; PackageVersion: May-1998; PackageReference: SO16; Publisher: Altium Limited; PackageDescription: 16-Pin Small Outline Integrated Circuit 1.27 mm Pitch; Code_IPC: SOIC127P600-16; ComponentLink1Description: Manufacturer Link; ComponentLink1URL: http://www.st.com/; ComponentLink2Description: Datasheet; ComponentLink2URL: http://www.st.com/stonline/products/literature/ds/5279/uln2001.pdf

## Sheet Externos.SchDoc
size A4
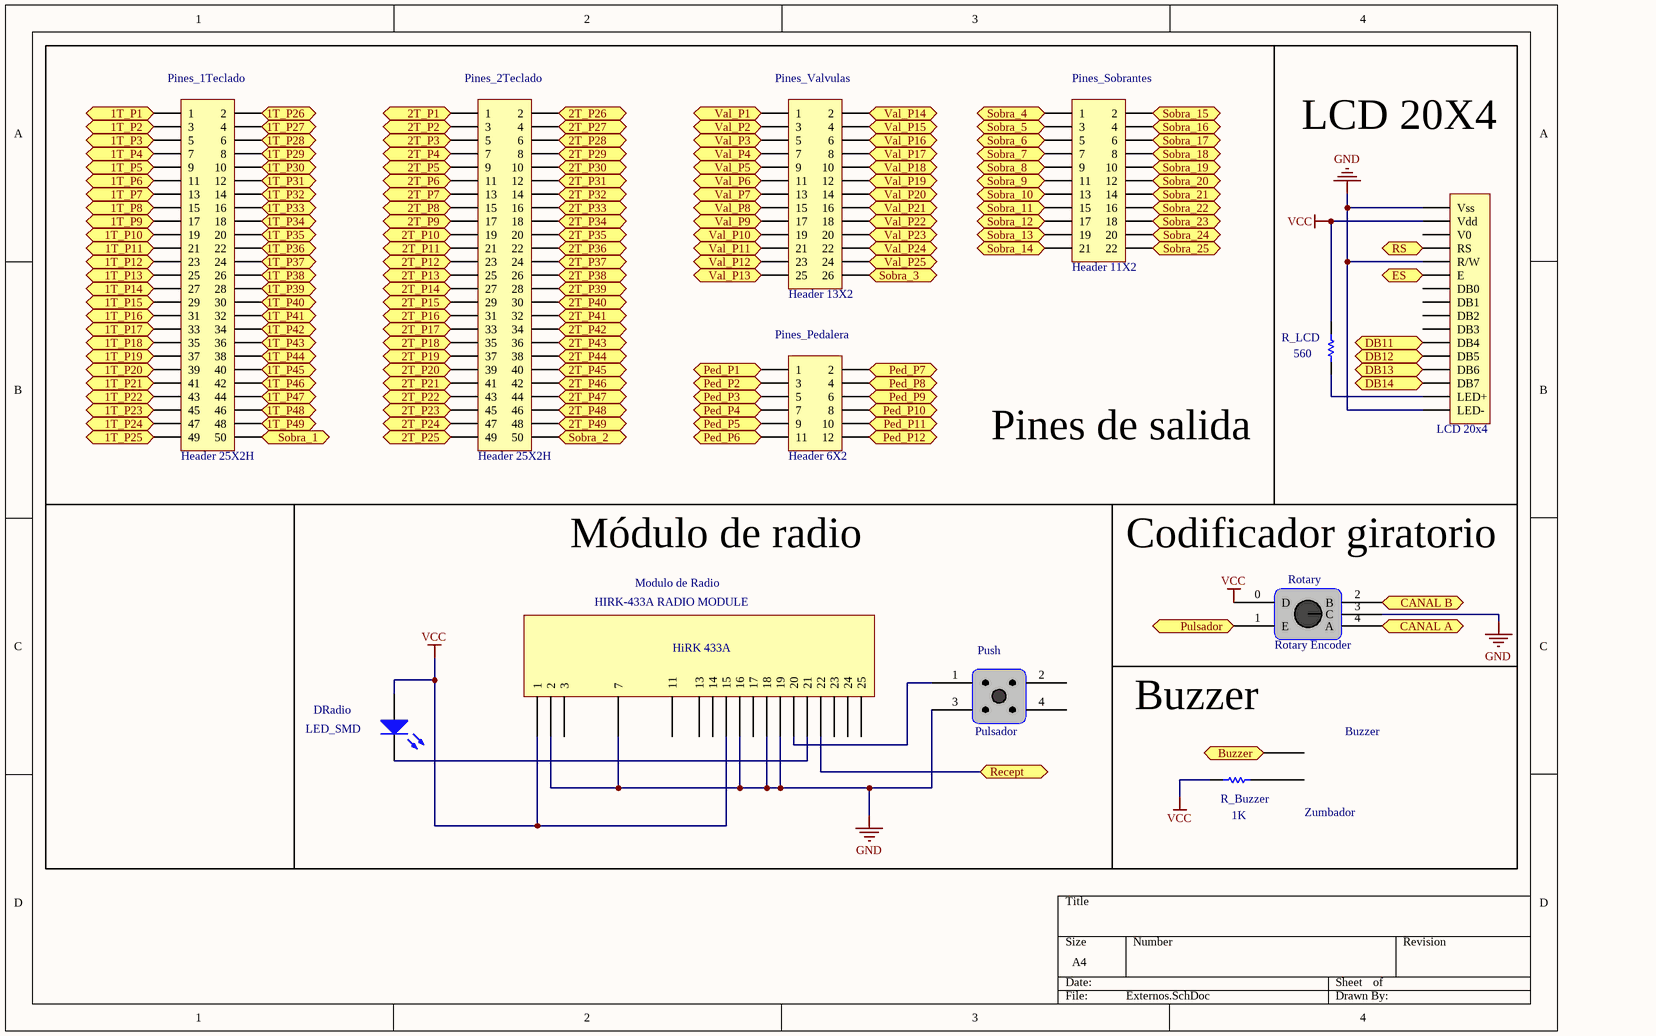
[diagram p4: Externos.SchDoc]

### Parts
?  Zumbador  [Buzzer]
DRadio  LED_SMD  [0805]
LCD_20x4  LCD 20x4  [LCD 4x20]  (value not drawn)
Modulo_de_Radio  HIRK-433A RADIO MODULE  [HIRK-433A RADIO MODULE]
Pines_1Teclado  Header 25X2H  [HDR2X25H]
Pines_2Teclado  Header 25X2H  [HDR2X25H]
Pines_Pedalera  Header 6X2  [HDR2X6]
Pines_Sobrantes  Header 11X2  [HDR2X11]
Pines_Valvulas  Header 13X2  [HDR2X13]
Push  Pulsador  [Pulsador]
R_Buzzer  value 1K  [0805 Chip Res]  (hidden comment: Res Chip 0805)
R_LCD  value 560  [0805 Chip Res]  (hidden comment: Res Chip 0805)
Rotary  Rotary Encoder  [RotaryPCB]

### Ports
1T_P1, 1T_P2, 1T_P3, 1T_P4, 1T_P5, 1T_P6, 1T_P7, 1T_P8, 1T_P9, 1T_P10, 1T_P11, 1T_P12, 1T_P13, 1T_P14, 1T_P15, 1T_P16, 1T_P17, 1T_P18, 1T_P19, 1T_P20, 1T_P21, 1T_P22, 1T_P23, 1T_P24, 1T_P25, 1T_P26, 1T_P27, 1T_P28, 1T_P29, 1T_P30, 1T_P31, 1T_P32, 1T_P33, 1T_P34, 1T_P35, 1T_P36, 1T_P37, 1T_P38, 1T_P39, 1T_P40, 1T_P41, 1T_P42, 1T_P43, 1T_P44, 1T_P45, 1T_P46, 1T_P47, 1T_P48, 1T_P49, 2T_P1, 2T_P2, 2T_P3, 2T_P4, 2T_P5, 2T_P6, 2T_P7, 2T_P8, 2T_P9, 2T_P10, 2T_P11, 2T_P12, 2T_P13, 2T_P14, 2T_P15, 2T_P16, 2T_P17, 2T_P18, 2T_P19, 2T_P20, 2T_P21, 2T_P22, 2T_P23, 2T_P24, 2T_P25, 2T_P26, 2T_P27, 2T_P28, 2T_P29, 2T_P30, 2T_P31, 2T_P32, 2T_P33, 2T_P34, 2T_P35, 2T_P36, 2T_P37, 2T_P38, 2T_P39, 2T_P40, 2T_P41, 2T_P42, 2T_P43, 2T_P44, 2T_P45, 2T_P46, 2T_P47, 2T_P48, 2T_P49, Buzzer, CANAL A, CANAL B, DB11, DB12, DB13, DB14, ES, Ped_P1, Ped_P2, Ped_P3, Ped_P4, Ped_P5, Ped_P6, Ped_P7, Ped_P8, Ped_P9, Ped_P10, Ped_P11, Ped_P12, Pulsador, Recept, RS, Sobra_1, Sobra_2, Sobra_3, Sobra_4, Sobra_5, Sobra_6, Sobra_7, Sobra_8, Sobra_9, Sobra_10, Sobra_11, Sobra_12, Sobra_13, Sobra_14, Sobra_15, Sobra_16, Sobra_17, Sobra_18, Sobra_19, Sobra_20, Sobra_21, Sobra_22, Sobra_23, Sobra_24, Sobra_25, Val_P1, Val_P2, Val_P3, Val_P4, Val_P5, Val_P6, Val_P7, Val_P8, Val_P9, Val_P10, Val_P11, Val_P12, Val_P13, Val_P14, Val_P15, Val_P16, Val_P17, Val_P18, Val_P19, Val_P20, Val_P21, Val_P22, Val_P23, Val_P24, Val_P25

### Nets
GND: LCD_20x4.1(Vss) LCD_20x4.5(R/W) LCD_20x4.16(LED-) Modulo_de_Radio.2 Modulo_de_Radio.7 Modulo_de_Radio.16 Modulo_de_Radio.18 Modulo_de_Radio.19 Push.3 Rotary.3(C)
VCC: DRadio.1(A) LCD_20x4.2(Vdd) Modulo_de_Radio.1 Modulo_de_Radio.15 R_Buzzer.2 R_LCD.2 Rotary.0(D)
Net1T7_1: Pines_1Teclado.50 ; port Sobra_1
Net1T7_2: Pines_2Teclado.50 ; port Sobra_2
Net1T7_3: Pines_Valvulas.26 ; port Sobra_3
Net1T7_4: Pines_Sobrantes.1 ; port Sobra_4
Net1T7_5: Pines_Sobrantes.3 ; port Sobra_5
Net1T7_6: Pines_Sobrantes.5 ; port Sobra_6
Net1T7_7: Pines_Sobrantes.7 ; port Sobra_7
Net1T_A1_10: Pines_1Teclado.13 ; port 1T_P7
Net1T_A1_11: Pines_1Teclado.11 ; port 1T_P6
Net1T_A1_12: Pines_1Teclado.9 ; port 1T_P5
Net1T_A1_13: Pines_1Teclado.7 ; port 1T_P4
Net1T_A1_14: Pines_1Teclado.5 ; port 1T_P3
Net1T_A1_15: Pines_1Teclado.3 ; port 1T_P2
Net1T_A1_16: Pines_1Teclado.1 ; port 1T_P1
Net1T_A2_10: Pines_1Teclado.27 ; port 1T_P14
Net1T_A2_11: Pines_1Teclado.25 ; port 1T_P13
Net1T_A2_12: Pines_1Teclado.23 ; port 1T_P12
Net1T_A2_13: Pines_1Teclado.21 ; port 1T_P11
Net1T_A2_14: Pines_1Teclado.19 ; port 1T_P10
Net1T_A2_15: Pines_1Teclado.17 ; port 1T_P9
Net1T_A2_16: Pines_1Teclado.15 ; port 1T_P8
Net1T_A3_10: Pines_1Teclado.41 ; port 1T_P21
Net1T_A3_11: Pines_1Teclado.39 ; port 1T_P20
Net1T_A3_12: Pines_1Teclado.37 ; port 1T_P19
Net1T_A3_13: Pines_1Teclado.35 ; port 1T_P18
Net1T_A3_14: Pines_1Teclado.33 ; port 1T_P17
Net1T_A3_15: Pines_1Teclado.31 ; port 1T_P16
Net1T_A3_16: Pines_1Teclado.29 ; port 1T_P15
Net1T_A4_10: Pines_1Teclado.6 ; port 1T_P28
Net1T_A4_11: Pines_1Teclado.4 ; port 1T_P27
Net1T_A4_12: Pines_1Teclado.2 ; port 1T_P26
Net1T_A4_13: Pines_1Teclado.49 ; port 1T_P25
Net1T_A4_14: Pines_1Teclado.47 ; port 1T_P24
Net1T_A4_15: Pines_1Teclado.45 ; port 1T_P23
Net1T_A4_16: Pines_1Teclado.43 ; port 1T_P22
Net1T_A5_10: Pines_1Teclado.20 ; port 1T_P35
Net1T_A5_11: Pines_1Teclado.18 ; port 1T_P34
Net1T_A5_12: Pines_1Teclado.16 ; port 1T_P33
Net1T_A5_13: Pines_1Teclado.14 ; port 1T_P32
Net1T_A5_14: Pines_1Teclado.12 ; port 1T_P31
Net1T_A5_15: Pines_1Teclado.10 ; port 1T_P30
Net1T_A5_16: Pines_1Teclado.8 ; port 1T_P29
Net1T_A6_10: Pines_1Teclado.34 ; port 1T_P42
Net1T_A6_11: Pines_1Teclado.32 ; port 1T_P41
Net1T_A6_12: Pines_1Teclado.30 ; port 1T_P40
Net1T_A6_13: Pines_1Teclado.28 ; port 1T_P39
Net1T_A6_14: Pines_1Teclado.26 ; port 1T_P38
Net1T_A6_15: Pines_1Teclado.24 ; port 1T_P37
Net1T_A6_16: Pines_1Teclado.22 ; port 1T_P36
Net1T_A7_10: Pines_1Teclado.48 ; port 1T_P49
Net1T_A7_11: Pines_1Teclado.46 ; port 1T_P48
Net1T_A7_12: Pines_1Teclado.44 ; port 1T_P47
Net1T_A7_13: Pines_1Teclado.42 ; port 1T_P46
Net1T_A7_14: Pines_1Teclado.40 ; port 1T_P45
Net1T_A7_15: Pines_1Teclado.38 ; port 1T_P44
Net1T_A7_16: Pines_1Teclado.36 ; port 1T_P43
Net2T7_1: Pines_Sobrantes.9 ; port Sobra_8
Net2T7_2: Pines_Sobrantes.11 ; port Sobra_9
Net2T7_3: Pines_Sobrantes.13 ; port Sobra_10
Net2T7_4: Pines_Sobrantes.15 ; port Sobra_11
Net2T7_5: Pines_Sobrantes.17 ; port Sobra_12
Net2T7_6: Pines_Sobrantes.19 ; port Sobra_13
Net2T7_7: Pines_Sobrantes.21 ; port Sobra_14
Net2T_A1_10: Pines_2Teclado.13 ; port 2T_P7
Net2T_A1_11: Pines_2Teclado.11 ; port 2T_P6
Net2T_A1_12: Pines_2Teclado.9 ; port 2T_P5
Net2T_A1_13: Pines_2Teclado.7 ; port 2T_P4
Net2T_A1_14: Pines_2Teclado.5 ; port 2T_P3
Net2T_A1_15: Pines_2Teclado.3 ; port 2T_P2
Net2T_A1_16: Pines_2Teclado.1 ; port 2T_P1
Net2T_A2_10: Pines_2Teclado.27 ; port 2T_P14
Net2T_A2_11: Pines_2Teclado.25 ; port 2T_P13
Net2T_A2_12: Pines_2Teclado.23 ; port 2T_P12
Net2T_A2_13: Pines_2Teclado.21 ; port 2T_P11
Net2T_A2_14: Pines_2Teclado.19 ; port 2T_P10
Net2T_A2_15: Pines_2Teclado.17 ; port 2T_P9
Net2T_A2_16: Pines_2Teclado.15 ; port 2T_P8
Net2T_A3_10: Pines_2Teclado.41 ; port 2T_P21
Net2T_A3_11: Pines_2Teclado.39 ; port 2T_P20
Net2T_A3_12: Pines_2Teclado.37 ; port 2T_P19
Net2T_A3_13: Pines_2Teclado.35 ; port 2T_P18
Net2T_A3_14: Pines_2Teclado.33 ; port 2T_P17
Net2T_A3_15: Pines_2Teclado.31 ; port 2T_P16
Net2T_A3_16: Pines_2Teclado.29 ; port 2T_P15
Net2T_A4_10: Pines_2Teclado.6 ; port 2T_P28
Net2T_A4_11: Pines_2Teclado.4 ; port 2T_P27
Net2T_A4_12: Pines_2Teclado.2 ; port 2T_P26
Net2T_A4_13: Pines_2Teclado.49 ; port 2T_P25
Net2T_A4_14: Pines_2Teclado.47 ; port 2T_P24
Net2T_A4_15: Pines_2Teclado.45 ; port 2T_P23
Net2T_A4_16: Pines_2Teclado.43 ; port 2T_P22
Net2T_A5_10: Pines_2Teclado.20 ; port 2T_P35
Net2T_A5_11: Pines_2Teclado.18 ; port 2T_P34
Net2T_A5_12: Pines_2Teclado.16 ; port 2T_P33
Net2T_A5_13: Pines_2Teclado.14 ; port 2T_P32
Net2T_A5_14: Pines_2Teclado.12 ; port 2T_P31
Net2T_A5_15: Pines_2Teclado.10 ; port 2T_P30
Net2T_A5_16: Pines_2Teclado.8 ; port 2T_P29
Net2T_A6_10: Pines_2Teclado.34 ; port 2T_P42
Net2T_A6_11: Pines_2Teclado.32 ; port 2T_P41
Net2T_A6_12: Pines_2Teclado.30 ; port 2T_P40
Net2T_A6_13: Pines_2Teclado.28 ; port 2T_P39
Net2T_A6_14: Pines_2Teclado.26 ; port 2T_P38
Net2T_A6_15: Pines_2Teclado.24 ; port 2T_P37
Net2T_A6_16: Pines_2Teclado.22 ; port 2T_P36
Net2T_A7_10: Pines_2Teclado.48 ; port 2T_P49
Net2T_A7_11: Pines_2Teclado.46 ; port 2T_P48
Net2T_A7_12: Pines_2Teclado.44 ; port 2T_P47
Net2T_A7_13: Pines_2Teclado.42 ; port 2T_P46
Net2T_A7_14: Pines_2Teclado.40 ; port 2T_P45
Net2T_A7_15: Pines_2Teclado.38 ; port 2T_P44
Net2T_A7_16: Pines_2Teclado.36 ; port 2T_P43
Net*_13: Modulo_de_Radio.22 ; port Recept
Net*_18: Rotary.4(A) ; port CANAL A
Net*_20: Rotary.2(B) ; port CANAL B
Net*_22: Rotary.1(E) ; port Pulsador
Net*_24: LCD_20x4.4(RS) ; port RS
Net*_26: LCD_20x4.6(E) ; port ES
Net*_32: LCD_20x4.11(DB4) ; port DB11
Net*_34: LCD_20x4.12(DB5) ; port DB12
Net*_36: LCD_20x4.13(DB6) ; port DB13
Net*_38: LCD_20x4.14(DB7) ; port DB14
Net*_40: ?.0 ; port Buzzer
Net?_1: ?.1 R_Buzzer.1
NetDRadio_2: DRadio.2(K) Modulo_de_Radio.21
NetLCD_20x4_15: LCD_20x4.15(LED+) R_LCD.1
NetModulo_de_Radio_20: Modulo_de_Radio.20 Push.1
NetPed2_4: Pines_Sobrantes.16 ; port Sobra_22
NetPed2_5: Pines_Sobrantes.18 ; port Sobra_23
NetPed2_6: Pines_Sobrantes.20 ; port Sobra_24
NetPed2_7: Pines_Sobrantes.22 ; port Sobra_25
NetPed_A1_10: Pines_Pedalera.2 ; port Ped_P7
NetPed_A1_11: Pines_Pedalera.11 ; port Ped_P6
NetPed_A1_12: Pines_Pedalera.9 ; port Ped_P5
NetPed_A1_13: Pines_Pedalera.7 ; port Ped_P4
NetPed_A1_14: Pines_Pedalera.5 ; port Ped_P3
NetPed_A1_15: Pines_Pedalera.3 ; port Ped_P2
NetPed_A1_16: Pines_Pedalera.1 ; port Ped_P1
NetPed_A2_12: Pines_Pedalera.12 ; port Ped_P12
NetPed_A2_13: Pines_Pedalera.10 ; port Ped_P11
NetPed_A2_14: Pines_Pedalera.8 ; port Ped_P10
NetPed_A2_15: Pines_Pedalera.6 ; port Ped_P9
NetPed_A2_16: Pines_Pedalera.4 ; port Ped_P8
NetPines_Sobrantes_2: Pines_Sobrantes.2 ; port Sobra_15
NetPines_Sobrantes_4: Pines_Sobrantes.4 ; port Sobra_16
NetPines_Sobrantes_6: Pines_Sobrantes.6 ; port Sobra_17
NetPines_Sobrantes_8: Pines_Sobrantes.8 ; port Sobra_18
NetPines_Sobrantes_10: Pines_Sobrantes.10 ; port Sobra_19
NetPines_Sobrantes_12: Pines_Sobrantes.12 ; port Sobra_20
NetPines_Sobrantes_14: Pines_Sobrantes.14 ; port Sobra_21
NetPines_Valvulas_1: Pines_Valvulas.1 ; port Val_P1
NetPines_Valvulas_2: Pines_Valvulas.2 ; port Val_P14
NetPines_Valvulas_3: Pines_Valvulas.3 ; port Val_P2
NetPines_Valvulas_4: Pines_Valvulas.4 ; port Val_P15
NetPines_Valvulas_5: Pines_Valvulas.5 ; port Val_P3
NetPines_Valvulas_6: Pines_Valvulas.6 ; port Val_P16
NetPines_Valvulas_7: Pines_Valvulas.7 ; port Val_P4
NetPines_Valvulas_8: Pines_Valvulas.8 ; port Val_P17
NetPines_Valvulas_9: Pines_Valvulas.9 ; port Val_P5
NetPines_Valvulas_10: Pines_Valvulas.10 ; port Val_P18
NetPines_Valvulas_11: Pines_Valvulas.11 ; port Val_P6
NetPines_Valvulas_12: Pines_Valvulas.12 ; port Val_P19
NetPines_Valvulas_13: Pines_Valvulas.13 ; port Val_P7
NetPines_Valvulas_14: Pines_Valvulas.14 ; port Val_P20
NetPines_Valvulas_15: Pines_Valvulas.15 ; port Val_P8
NetPines_Valvulas_16: Pines_Valvulas.16 ; port Val_P21
NetPines_Valvulas_17: Pines_Valvulas.17 ; port Val_P9
NetPines_Valvulas_18: Pines_Valvulas.18 ; port Val_P22
NetPines_Valvulas_19: Pines_Valvulas.19 ; port Val_P10
NetPines_Valvulas_20: Pines_Valvulas.20 ; port Val_P23
NetPines_Valvulas_21: Pines_Valvulas.21 ; port Val_P11
NetPines_Valvulas_22: Pines_Valvulas.22 ; port Val_P24
NetPines_Valvulas_23: Pines_Valvulas.23 ; port Val_P12
NetPines_Valvulas_24: Pines_Valvulas.24 ; port Val_P25
NetPines_Valvulas_25: Pines_Valvulas.25 ; port Val_P13

Not connected (* = marked no-connect by the designer): LCD_20x4 3(V0) 7(DB0) 8(DB1) 9(DB2) 10(DB3); Modulo_de_Radio 3 11 13 14 17 23 24 25; Push 2 4

### Notes on the sheet
- LCD 20X4
- (near R_LCD) Pines de salida
- Módulo de radio
- (near Rotary) Codificador giratorio
- Buzzer
- (in symbol HIRK-433A RADIO MODULE) HiRK 433A

### Library data of the parts
? = Buzzer
DRadio = LED_SMD: LED SMD; Published: 8-Jun-2000; LatestRevisionDate: 08-Jul-2005; LatestRevisionNote: Mech Layer 1 removed.; PackageReference: LED-0; Publisher: Altium Limited
Pines_1Teclado Pines_2Teclado = Header 25X2H: Header, 25-Pin, Dual row, Right Angle; LatestRevisionDate: 17-Jul-2002; LatestRevisionNote: Re-released for DXP Platform.; Publisher: Altium Limited
Pines_Pedalera = Header 6X2: Header, 6-Pin, Dual row; LatestRevisionDate: 17-Jul-2002; LatestRevisionNote: Re-released for DXP Platform.; Publisher: Altium Limited
Pines_Sobrantes = Header 11X2: Header, 11-Pin, Dual row; LatestRevisionDate: 17-Jul-2002; LatestRevisionNote: Re-released for DXP Platform.; Publisher: Altium Limited
Pines_Valvulas = Header 13X2: Header, 13-Pin, Dual row; LatestRevisionDate: 17-Jul-2002; LatestRevisionNote: Re-released for DXP Platform.; Publisher: Altium Limited
R_Buzzer R_LCD = Resistencia: Published: 8-Jun-2000; LatestRevisionDate: 17-Jul-2002; LatestRevisionNote: Re-released for DXP Platform.; PackageReference: AXIAL-0.3; Publisher: Altium Limited; PackageDescription: Axial Device, Thru-Hole; 2 Leads; 0.3 in Pin Spacing
Rotary = Rotary Encoder: pin to pad: 0>D 1>E 2>B 3>C 4>A
LCD_20x4 = LCD 20x4: LatestRevisionDate: 17-Jul-2002; LatestRevisionNote: Re-released for DXP Platform.; Publisher: Altium Limited

## Sheet GPIO_Raspberry_b+.SchDoc
size A4
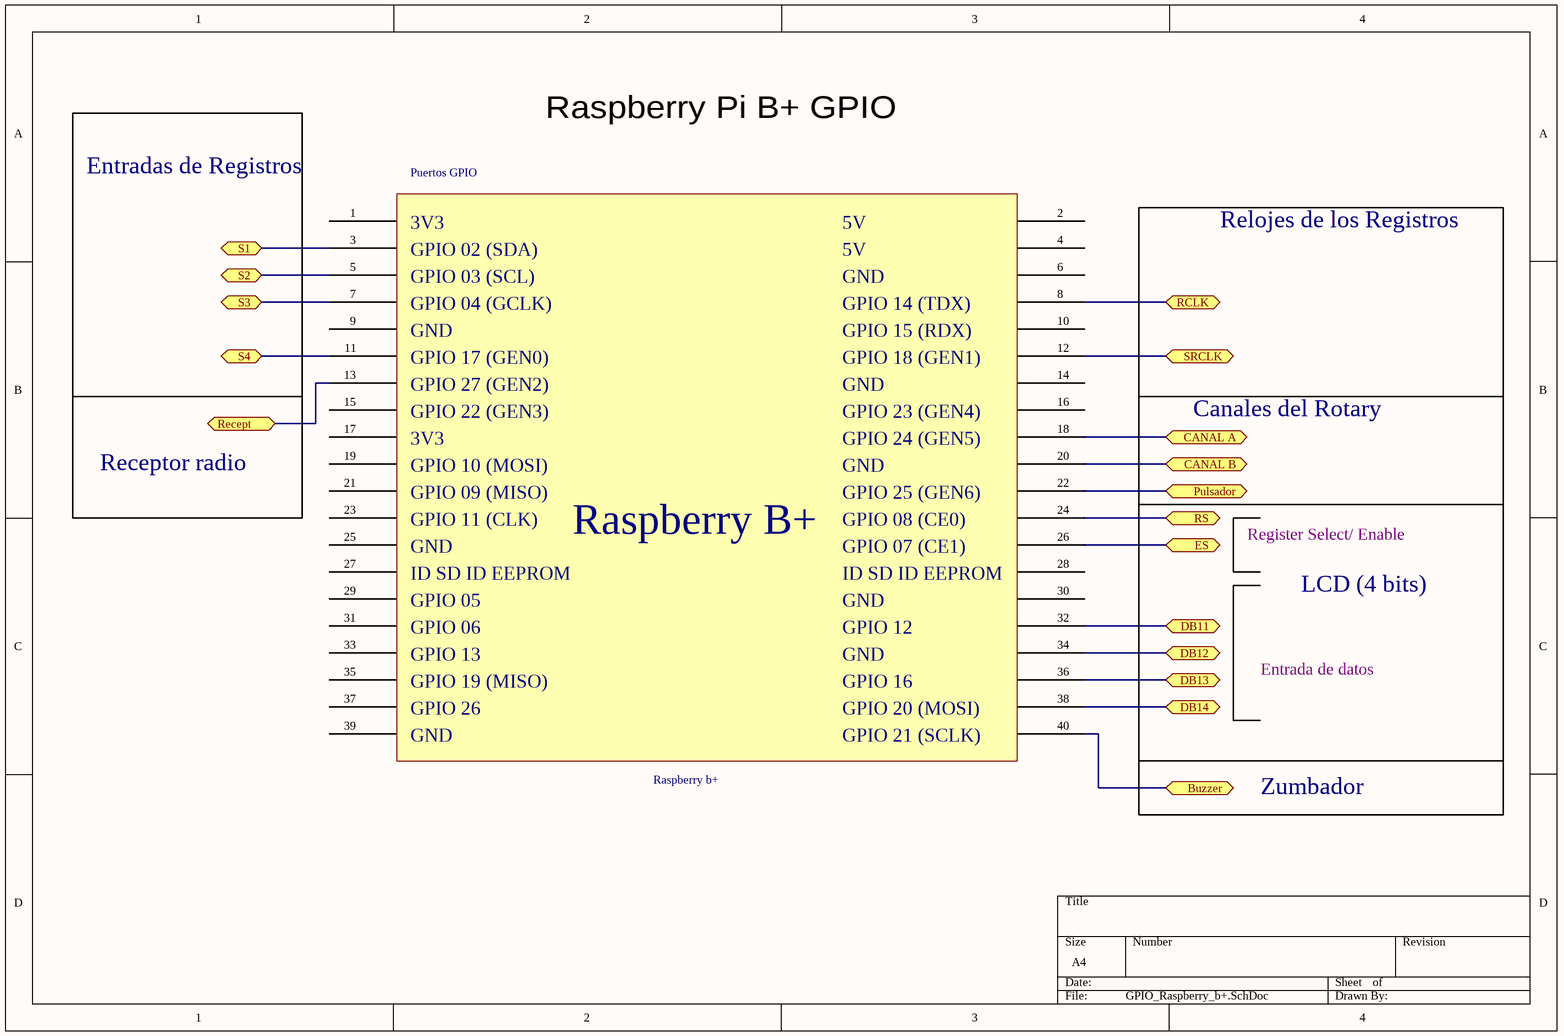
[diagram p5: GPIO_Raspberry_b+.SchDoc]

### Parts
*  Raspberry b+

### Ports
Buzzer, CANAL A, CANAL B, DB11, DB12, DB13, DB14, ES, Pulsador, RCLK, Recept, RS, S1, S2, S3, S4, SRCLK

### Nets
Net1T1_14: *.3 ; port S1
Net2T2#1_14: *.5 ; port S2
Net*_7: *.7 ; port S3
Net*_8: *.8 ; port RCLK
Net*_11: *.11 ; port S4
Net*_12: *.12 ; port SRCLK
Net*_13: *.13 ; port Recept
Net*_18: *.18 ; port CANAL A
Net*_20: *.20 ; port CANAL B
Net*_22: *.22 ; port Pulsador
Net*_24: *.24 ; port RS
Net*_26: *.26 ; port ES
Net*_32: *.32 ; port DB11
Net*_34: *.34 ; port DB12
Net*_36: *.36 ; port DB13
Net*_38: *.38 ; port DB14
Net*_40: *.40 ; port Buzzer

Not connected (* = marked no-connect by the designer): * 1 2 4 6 9 10 14 15 16 17 19 21 23 25 27 28 29 30 31 33 35 37 39

### Notes on the sheet
- (near *) Entradas de Registros
- (near *) Puertos GPIO
- Raspberry Pi B+ GPIO
- Relojes de los Registros
- Canales del Rotary
- Receptor radio
- Register Select/ Enable
- LCD (4 bits)
- Entrada de datos
- Zumbador
- (in symbol Raspberry b+) 3V3; 5V; GPIO 02 (SDA); GPIO 03 (SCL); GND; GPIO 04 (GCLK); GPIO 14 (TDX); GPIO 15 (RDX); GPIO 17 (GEN0); GPIO 18 (GEN1); GPIO 27 (GEN2); GPIO 22 (GEN3); GPIO 23 (GEN4); GPIO 24 (GEN5); GPIO 10 (MOSI); GPIO 09 (MISO); GPIO 25 (GEN6); GPIO 11 (CLK); GPIO 08 (CE0); Raspberry B+; GPIO 07 (CE1); ID SD ID EEPROM; GPIO 05; GPIO 06; GPIO 12; GPIO 13; GPIO 19 (MISO); GPIO 16; GPIO 26; GPIO 20 (MOSI); GPIO 21 (SCLK)

## Sheet LED´s_1Teclado.SchDoc
size A4
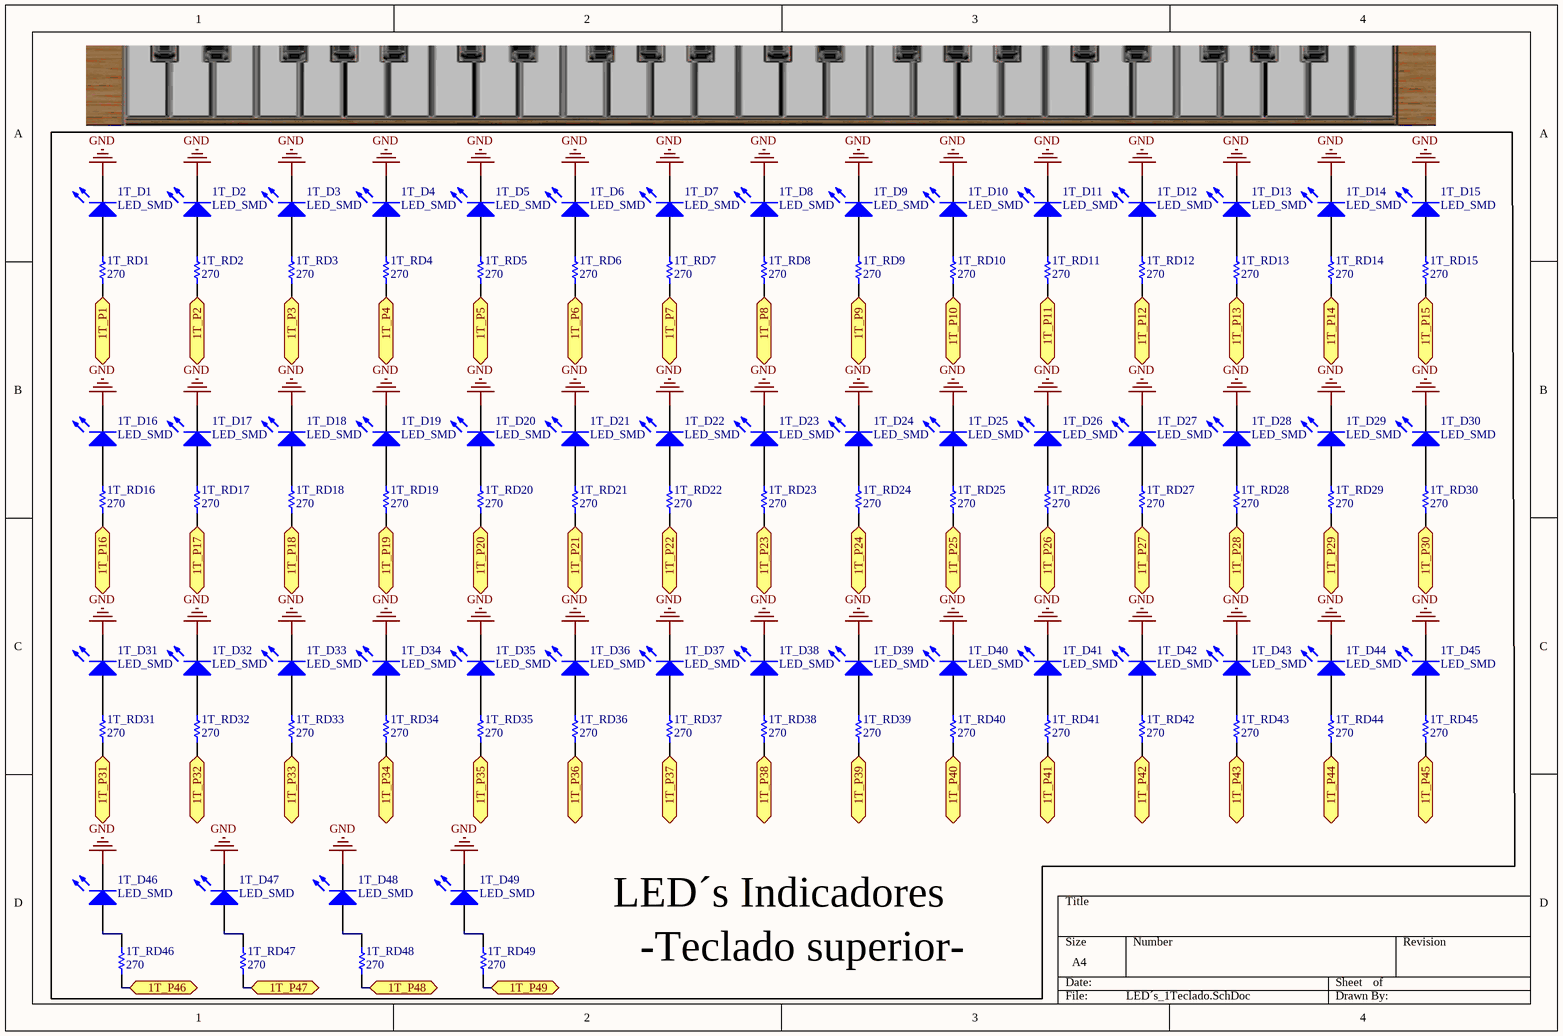
[diagram p6: LED´s_1Teclado.SchDoc]

### Parts
1T_D1  LED_SMD  [0805]
1T_D2  LED_SMD  [0805]
1T_D3  LED_SMD  [0805]
1T_D4  LED_SMD  [0805]
1T_D5  LED_SMD  [0805]
1T_D6  LED_SMD  [0805]
1T_D7  LED_SMD  [0805]
1T_D8  LED_SMD  [0805]
1T_D9  LED_SMD  [0805]
1T_D10  LED_SMD  [0805]
1T_D11  LED_SMD  [0805]
1T_D12  LED_SMD  [0805]
1T_D13  LED_SMD  [0805]
1T_D14  LED_SMD  [0805]
1T_D15  LED_SMD  [0805]
1T_D16  LED_SMD  [0805]
1T_D17  LED_SMD  [0805]
1T_D18  LED_SMD  [0805]
1T_D19  LED_SMD  [0805]
1T_D20  LED_SMD  [0805]
1T_D21  LED_SMD  [0805]
1T_D22  LED_SMD  [0805]
1T_D23  LED_SMD  [0805]
1T_D24  LED_SMD  [0805]
1T_D25  LED_SMD  [0805]
1T_D26  LED_SMD  [0805]
1T_D27  LED_SMD  [0805]
1T_D28  LED_SMD  [0805]
1T_D29  LED_SMD  [0805]
1T_D30  LED_SMD  [0805]
1T_D31  LED_SMD  [0805]
1T_D32  LED_SMD  [0805]
1T_D33  LED_SMD  [0805]
1T_D34  LED_SMD  [0805]
1T_D35  LED_SMD  [0805]
1T_D36  LED_SMD  [0805]
1T_D37  LED_SMD  [0805]
1T_D38  LED_SMD  [0805]
1T_D39  LED_SMD  [0805]
1T_D40  LED_SMD  [0805]
1T_D41  LED_SMD  [0805]
1T_D42  LED_SMD  [0805]
1T_D43  LED_SMD  [0805]
1T_D44  LED_SMD  [0805]
1T_D45  LED_SMD  [0805]
1T_D46  LED_SMD  [0805]
1T_D47  LED_SMD  [0805]
1T_D48  LED_SMD  [0805]
1T_D49  LED_SMD  [0805]
1T_RD1  value 270  [0805 Chip Res]  (hidden comment: Res Chip 0805)
1T_RD2  value 270  [0805 Chip Res]  (hidden comment: Res Chip 0805)
1T_RD3  value 270  [0805 Chip Res]  (hidden comment: Res Chip 0805)
1T_RD4  value 270  [0805 Chip Res]  (hidden comment: Res Chip 0805)
1T_RD5  value 270  [0805 Chip Res]  (hidden comment: Res Chip 0805)
1T_RD6  value 270  [0805 Chip Res]  (hidden comment: Res Chip 0805)
1T_RD7  value 270  [0805 Chip Res]  (hidden comment: Res Chip 0805)
1T_RD8  value 270  [0805 Chip Res]  (hidden comment: Res Chip 0805)
1T_RD9  value 270  [0805 Chip Res]  (hidden comment: Res Chip 0805)
1T_RD10  value 270  [0805 Chip Res]  (hidden comment: Res Chip 0805)
1T_RD11  value 270  [0805 Chip Res]  (hidden comment: Res Chip 0805)
1T_RD12  value 270  [0805 Chip Res]  (hidden comment: Res Chip 0805)
1T_RD13  value 270  [0805 Chip Res]  (hidden comment: Res Chip 0805)
1T_RD14  value 270  [0805 Chip Res]  (hidden comment: Res Chip 0805)
1T_RD15  value 270  [0805 Chip Res]  (hidden comment: Res Chip 0805)
1T_RD16  value 270  [0805 Chip Res]  (hidden comment: Res Chip 0805)
1T_RD17  value 270  [0805 Chip Res]  (hidden comment: Res Chip 0805)
1T_RD18  value 270  [0805 Chip Res]  (hidden comment: Res Chip 0805)
1T_RD19  value 270  [0805 Chip Res]  (hidden comment: Res Chip 0805)
1T_RD20  value 270  [0805 Chip Res]  (hidden comment: Res Chip 0805)
1T_RD21  value 270  [0805 Chip Res]  (hidden comment: Res Chip 0805)
1T_RD22  value 270  [0805 Chip Res]  (hidden comment: Res Chip 0805)
1T_RD23  value 270  [0805 Chip Res]  (hidden comment: Res Chip 0805)
1T_RD24  value 270  [0805 Chip Res]  (hidden comment: Res Chip 0805)
1T_RD25  value 270  [0805 Chip Res]  (hidden comment: Res Chip 0805)
1T_RD26  value 270  [0805 Chip Res]  (hidden comment: Res Chip 0805)
1T_RD27  value 270  [0805 Chip Res]  (hidden comment: Res Chip 0805)
1T_RD28  value 270  [0805 Chip Res]  (hidden comment: Res Chip 0805)
1T_RD29  value 270  [0805 Chip Res]  (hidden comment: Res Chip 0805)
1T_RD30  value 270  [0805 Chip Res]  (hidden comment: Res Chip 0805)
1T_RD31  value 270  [0805 Chip Res]  (hidden comment: Res Chip 0805)
1T_RD32  value 270  [0805 Chip Res]  (hidden comment: Res Chip 0805)
1T_RD33  value 270  [0805 Chip Res]  (hidden comment: Res Chip 0805)
1T_RD34  value 270  [0805 Chip Res]  (hidden comment: Res Chip 0805)
1T_RD35  value 270  [0805 Chip Res]  (hidden comment: Res Chip 0805)
1T_RD36  value 270  [0805 Chip Res]  (hidden comment: Res Chip 0805)
1T_RD37  value 270  [0805 Chip Res]  (hidden comment: Res Chip 0805)
1T_RD38  value 270  [0805 Chip Res]  (hidden comment: Res Chip 0805)
1T_RD39  value 270  [0805 Chip Res]  (hidden comment: Res Chip 0805)
1T_RD40  value 270  [0805 Chip Res]  (hidden comment: Res Chip 0805)
1T_RD41  value 270  [0805 Chip Res]  (hidden comment: Res Chip 0805)
1T_RD42  value 270  [0805 Chip Res]  (hidden comment: Res Chip 0805)
1T_RD43  value 270  [0805 Chip Res]  (hidden comment: Res Chip 0805)
1T_RD44  value 270  [0805 Chip Res]  (hidden comment: Res Chip 0805)
1T_RD45  value 270  [0805 Chip Res]  (hidden comment: Res Chip 0805)
1T_RD46  value 270  [0805 Chip Res]  (hidden comment: Res Chip 0805)
1T_RD47  value 270  [0805 Chip Res]  (hidden comment: Res Chip 0805)
1T_RD48  value 270  [0805 Chip Res]  (hidden comment: Res Chip 0805)
1T_RD49  value 270  [0805 Chip Res]  (hidden comment: Res Chip 0805)

### Ports
1T_P1, 1T_P2, 1T_P3, 1T_P4, 1T_P5, 1T_P6, 1T_P7, 1T_P8, 1T_P9, 1T_P10, 1T_P11, 1T_P12, 1T_P13, 1T_P14, 1T_P15, 1T_P16, 1T_P17, 1T_P18, 1T_P19, 1T_P20, 1T_P21, 1T_P22, 1T_P23, 1T_P24, 1T_P25, 1T_P26, 1T_P27, 1T_P28, 1T_P29, 1T_P30, 1T_P31, 1T_P32, 1T_P33, 1T_P34, 1T_P35, 1T_P36, 1T_P37, 1T_P38, 1T_P39, 1T_P40, 1T_P41, 1T_P42, 1T_P43, 1T_P44, 1T_P45, 1T_P46, 1T_P47, 1T_P48, 1T_P49

### Nets
GND: 1T_D1.2(K) 1T_D2.2(K) 1T_D3.2(K) 1T_D4.2(K) 1T_D5.2(K) 1T_D6.2(K) 1T_D7.2(K) 1T_D8.2(K) 1T_D9.2(K) 1T_D10.2(K) 1T_D11.2(K) 1T_D12.2(K) 1T_D13.2(K) 1T_D14.2(K) 1T_D15.2(K) 1T_D16.2(K) 1T_D17.2(K) 1T_D18.2(K) 1T_D19.2(K) 1T_D20.2(K) 1T_D21.2(K) 1T_D22.2(K) 1T_D23.2(K) 1T_D24.2(K) 1T_D25.2(K) 1T_D26.2(K) 1T_D27.2(K) 1T_D28.2(K) 1T_D29.2(K) 1T_D30.2(K) 1T_D31.2(K) 1T_D32.2(K) 1T_D33.2(K) 1T_D34.2(K) 1T_D35.2(K) 1T_D36.2(K) 1T_D37.2(K) 1T_D38.2(K) 1T_D39.2(K) 1T_D40.2(K) 1T_D41.2(K) 1T_D42.2(K) 1T_D43.2(K) 1T_D44.2(K) 1T_D45.2(K) 1T_D46.2(K) 1T_D47.2(K) 1T_D48.2(K) 1T_D49.2(K)
Net1T_A1_10: 1T_RD7.1 ; port 1T_P7
Net1T_A1_11: 1T_RD6.1 ; port 1T_P6
Net1T_A1_12: 1T_RD5.1 ; port 1T_P5
Net1T_A1_13: 1T_RD4.1 ; port 1T_P4
Net1T_A1_14: 1T_RD3.1 ; port 1T_P3
Net1T_A1_15: 1T_RD2.1 ; port 1T_P2
Net1T_A1_16: 1T_RD1.1 ; port 1T_P1
Net1T_A2_10: 1T_RD14.1 ; port 1T_P14
Net1T_A2_11: 1T_RD13.1 ; port 1T_P13
Net1T_A2_12: 1T_RD12.1 ; port 1T_P12
Net1T_A2_13: 1T_RD11.1 ; port 1T_P11
Net1T_A2_14: 1T_RD10.1 ; port 1T_P10
Net1T_A2_15: 1T_RD9.1 ; port 1T_P9
Net1T_A2_16: 1T_RD8.1 ; port 1T_P8
Net1T_A3_10: 1T_RD21.1 ; port 1T_P21
Net1T_A3_11: 1T_RD20.1 ; port 1T_P20
Net1T_A3_12: 1T_RD19.1 ; port 1T_P19
Net1T_A3_13: 1T_RD18.1 ; port 1T_P18
Net1T_A3_14: 1T_RD17.1 ; port 1T_P17
Net1T_A3_15: 1T_RD16.1 ; port 1T_P16
Net1T_A3_16: 1T_RD15.1 ; port 1T_P15
Net1T_A4_10: 1T_RD28.1 ; port 1T_P28
Net1T_A4_11: 1T_RD27.1 ; port 1T_P27
Net1T_A4_12: 1T_RD26.1 ; port 1T_P26
Net1T_A4_13: 1T_RD25.1 ; port 1T_P25
Net1T_A4_14: 1T_RD24.1 ; port 1T_P24
Net1T_A4_15: 1T_RD23.1 ; port 1T_P23
Net1T_A4_16: 1T_RD22.1 ; port 1T_P22
Net1T_A5_10: 1T_RD35.1 ; port 1T_P35
Net1T_A5_11: 1T_RD34.1 ; port 1T_P34
Net1T_A5_12: 1T_RD33.1 ; port 1T_P33
Net1T_A5_13: 1T_RD32.1 ; port 1T_P32
Net1T_A5_14: 1T_RD31.1 ; port 1T_P31
Net1T_A5_15: 1T_RD30.1 ; port 1T_P30
Net1T_A5_16: 1T_RD29.1 ; port 1T_P29
Net1T_A6_10: 1T_RD42.1 ; port 1T_P42
Net1T_A6_11: 1T_RD41.1 ; port 1T_P41
Net1T_A6_12: 1T_RD40.1 ; port 1T_P40
Net1T_A6_13: 1T_RD39.1 ; port 1T_P39
Net1T_A6_14: 1T_RD38.1 ; port 1T_P38
Net1T_A6_15: 1T_RD37.1 ; port 1T_P37
Net1T_A6_16: 1T_RD36.1 ; port 1T_P36
Net1T_A7_10: 1T_RD49.1 ; port 1T_P49
Net1T_A7_11: 1T_RD48.1 ; port 1T_P48
Net1T_A7_12: 1T_RD47.1 ; port 1T_P47
Net1T_A7_13: 1T_RD46.1 ; port 1T_P46
Net1T_A7_14: 1T_RD45.1 ; port 1T_P45
Net1T_A7_15: 1T_RD44.1 ; port 1T_P44
Net1T_A7_16: 1T_RD43.1 ; port 1T_P43
Net1T_D1_1: 1T_D1.1(A) 1T_RD1.2
Net1T_D2_1: 1T_D2.1(A) 1T_RD2.2
Net1T_D3_1: 1T_D3.1(A) 1T_RD3.2
Net1T_D4_1: 1T_D4.1(A) 1T_RD4.2
Net1T_D5_1: 1T_D5.1(A) 1T_RD5.2
Net1T_D6_1: 1T_D6.1(A) 1T_RD6.2
Net1T_D7_1: 1T_D7.1(A) 1T_RD7.2
Net1T_D8_1: 1T_D8.1(A) 1T_RD8.2
Net1T_D9_1: 1T_D9.1(A) 1T_RD9.2
Net1T_D10_1: 1T_D10.1(A) 1T_RD10.2
Net1T_D11_1: 1T_D11.1(A) 1T_RD11.2
Net1T_D12_1: 1T_D12.1(A) 1T_RD12.2
Net1T_D13_1: 1T_D13.1(A) 1T_RD13.2
Net1T_D14_1: 1T_D14.1(A) 1T_RD14.2
Net1T_D15_1: 1T_D15.1(A) 1T_RD15.2
Net1T_D16_1: 1T_D16.1(A) 1T_RD16.2
Net1T_D17_1: 1T_D17.1(A) 1T_RD17.2
Net1T_D18_1: 1T_D18.1(A) 1T_RD18.2
Net1T_D19_1: 1T_D19.1(A) 1T_RD19.2
Net1T_D20_1: 1T_D20.1(A) 1T_RD20.2
Net1T_D21_1: 1T_D21.1(A) 1T_RD21.2
Net1T_D22_1: 1T_D22.1(A) 1T_RD22.2
Net1T_D23_1: 1T_D23.1(A) 1T_RD23.2
Net1T_D24_1: 1T_D24.1(A) 1T_RD24.2
Net1T_D25_1: 1T_D25.1(A) 1T_RD25.2
Net1T_D26_1: 1T_D26.1(A) 1T_RD26.2
Net1T_D27_1: 1T_D27.1(A) 1T_RD27.2
Net1T_D28_1: 1T_D28.1(A) 1T_RD28.2
Net1T_D29_1: 1T_D29.1(A) 1T_RD29.2
Net1T_D30_1: 1T_D30.1(A) 1T_RD30.2
Net1T_D31_1: 1T_D31.1(A) 1T_RD31.2
Net1T_D32_1: 1T_D32.1(A) 1T_RD32.2
Net1T_D33_1: 1T_D33.1(A) 1T_RD33.2
Net1T_D34_1: 1T_D34.1(A) 1T_RD34.2
Net1T_D35_1: 1T_D35.1(A) 1T_RD35.2
Net1T_D36_1: 1T_D36.1(A) 1T_RD36.2
Net1T_D37_1: 1T_D37.1(A) 1T_RD37.2
Net1T_D38_1: 1T_D38.1(A) 1T_RD38.2
Net1T_D39_1: 1T_D39.1(A) 1T_RD39.2
Net1T_D40_1: 1T_D40.1(A) 1T_RD40.2
Net1T_D41_1: 1T_D41.1(A) 1T_RD41.2
Net1T_D42_1: 1T_D42.1(A) 1T_RD42.2
Net1T_D43_1: 1T_D43.1(A) 1T_RD43.2
Net1T_D44_1: 1T_D44.1(A) 1T_RD44.2
Net1T_D45_1: 1T_D45.1(A) 1T_RD45.2
Net1T_D46_1: 1T_D46.1(A) 1T_RD46.2
Net1T_D47_1: 1T_D47.1(A) 1T_RD47.2
Net1T_D48_1: 1T_D48.1(A) 1T_RD48.2
Net1T_D49_1: 1T_D49.1(A) 1T_RD49.2

### Notes on the sheet
- LED´s Indicadores
- -Teclado superior-

### Library data of the parts
1T_D1-1T_D49 = LED_SMD: LED SMD; Published: 8-Jun-2000; LatestRevisionDate: 08-Jul-2005; LatestRevisionNote: Mech Layer 1 removed.; PackageReference: LED-0; Publisher: Altium Limited
1T_RD1-1T_RD49 = Resistencia: Published: 8-Jun-2000; LatestRevisionDate: 17-Jul-2002; LatestRevisionNote: Re-released for DXP Platform.; PackageReference: AXIAL-0.3; Publisher: Altium Limited; PackageDescription: Axial Device, Thru-Hole; 2 Leads; 0.3 in Pin Spacing